# EAGLE design KMO_IO_MV2_9_mout (EAGLE 9.5.1)

## Sheet 1 of 2
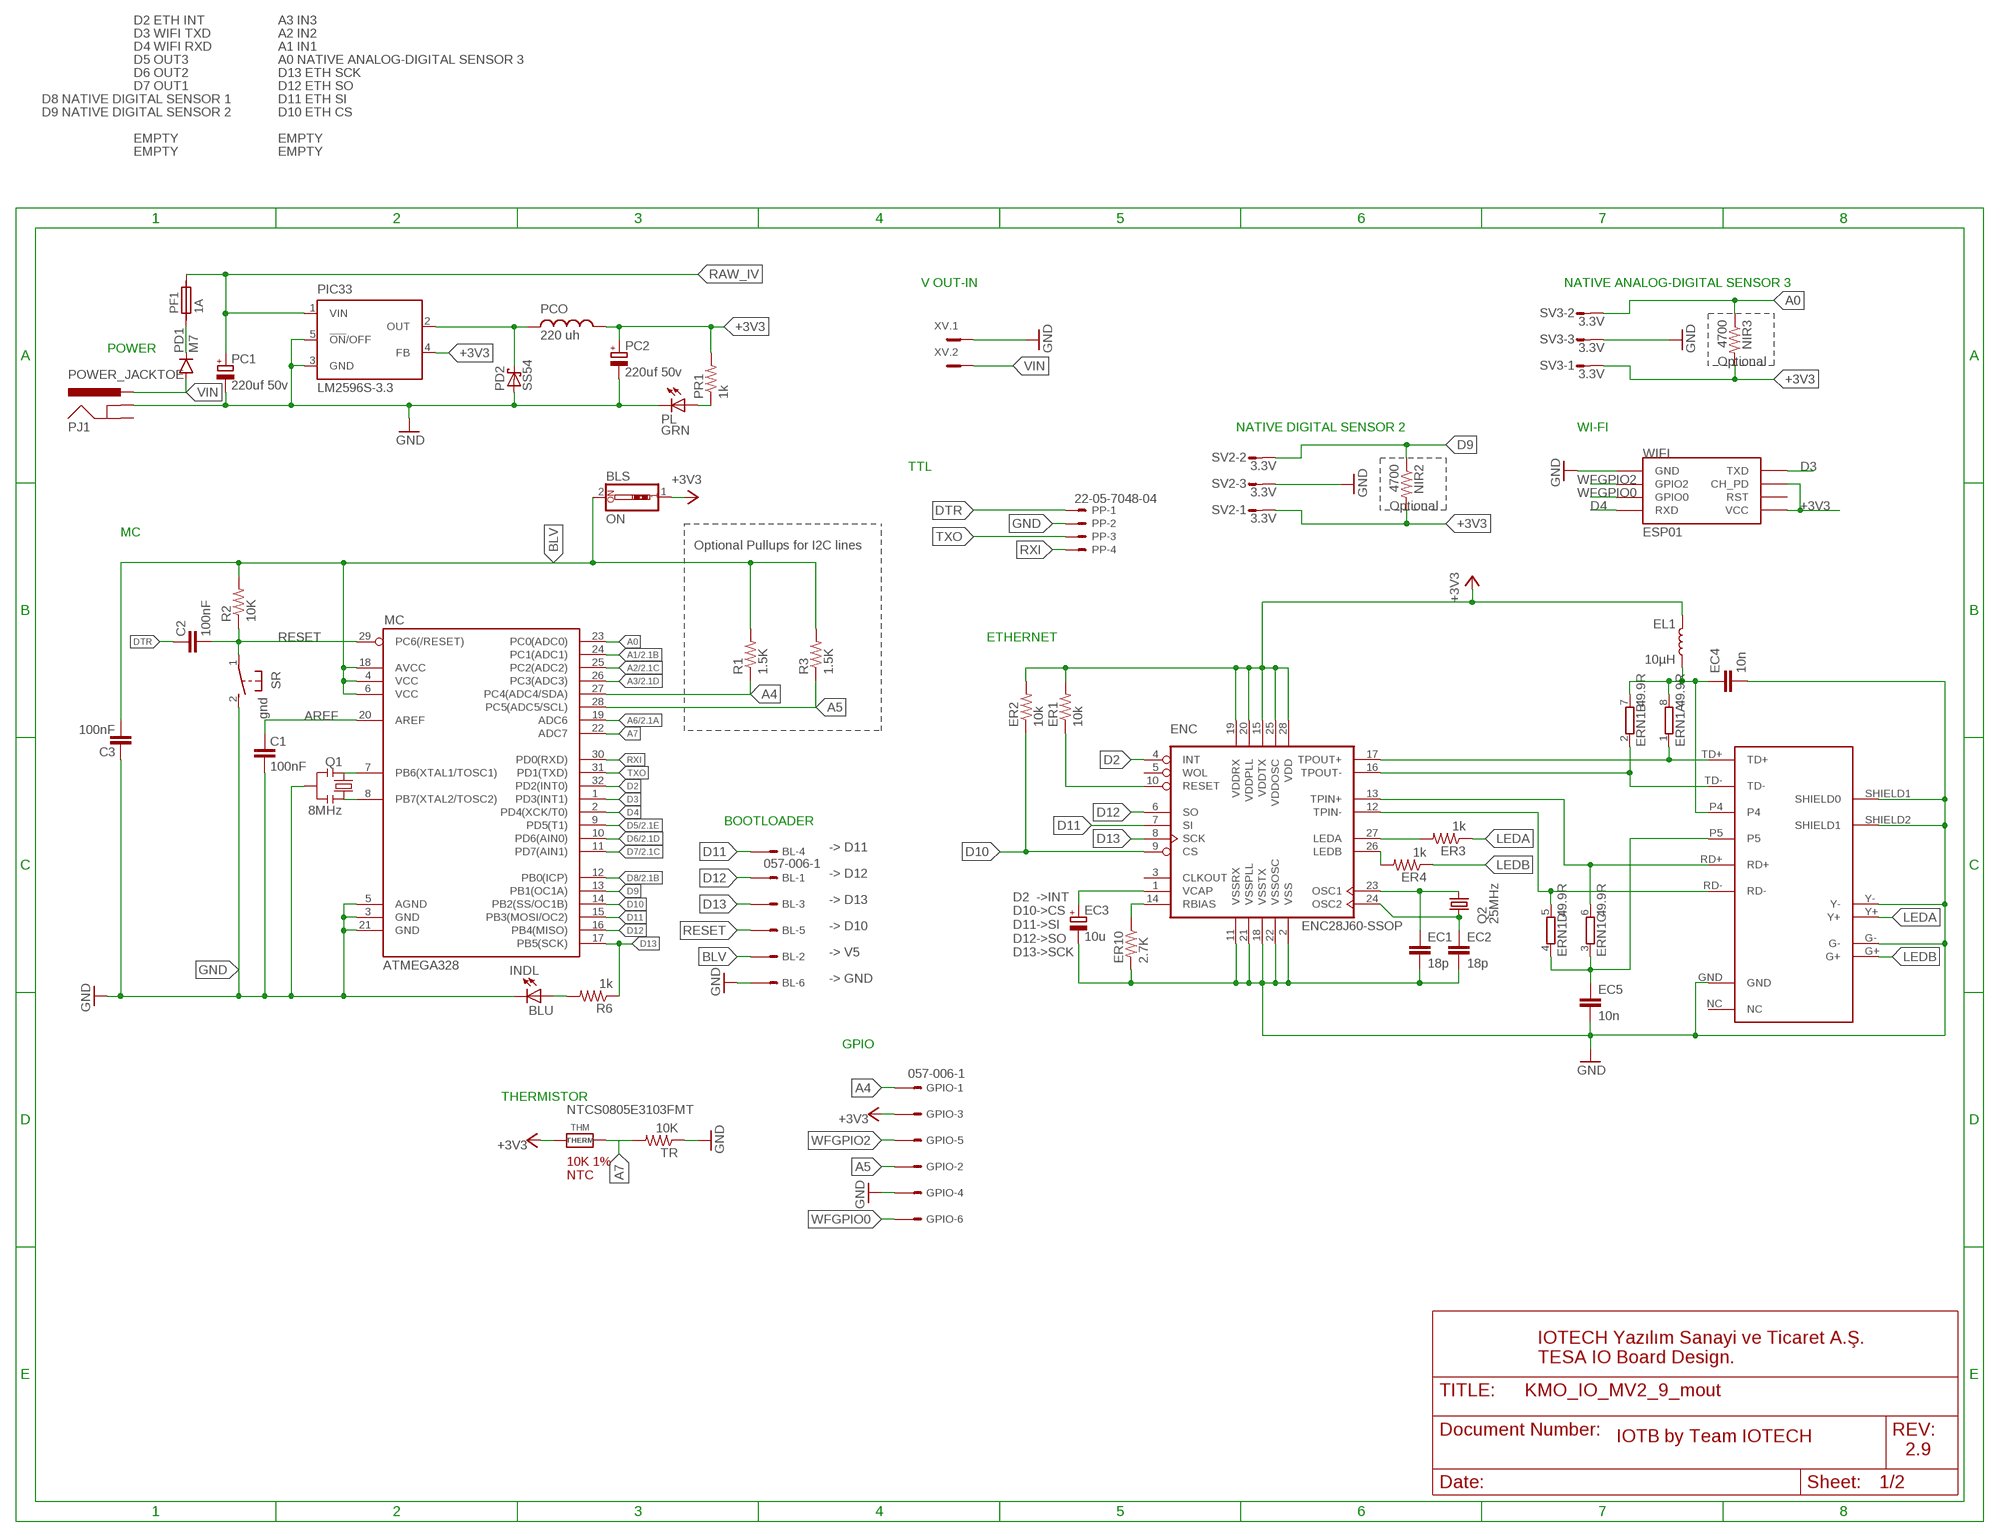
[diagram p0: schematic, sheet 1]

### Parts
BL  057-006-1  [057-006-1]
BLS  ON  SW_DIP-1  [EDG-01]
C1  100nF  CAP0805  [0805]
C2  100nF  CAP0805  [0805]
C3  100nF  CAP0805  [0805]
EC1  18p  CAP0805  [0805]
EC2  18p  CAP0805  [0805]
EC3  10u  CPOL-EUCT3216  [CT3216]
EC4  10n  CAP0805  [0805]
EC5  10n  CAP0805  [0805]
EL1  10µH  INDUCTOR-0805-3.3UH  [0805]
ENC  ENC28J60-SSOP  [SSOP28]
ER1  10k  RESISTOR0805-RES  [0805]
ER2  10k  RESISTOR0805-RES  [0805]
ER3  1k  RESISTOR0805-RES  [0805]
ER4  1k  RESISTOR0805-RES  [0805]
ER10  2.7K  RESISTOR0805-RES  [0805]
ERN1  49.9R  4R-N0603-ARV  [0603-ARV]
GPIO  057-006-1  [057-006-1]
INDL  BLU  LEDCHIP-LED0805  [CHIP-LED0805]
MC  ATMEGA328  ATMEGA168  [TQFP32-08]
NIR2  4700  RESISTOR0805-RES  [0805]
NIR3  4700  RESISTOR0805-RES  [0805]
PC1  220uf 50v  CPOL-EU140CLH-1010  [140CLH-1010]
PC2  220uf 50v  CPOL-EU140CLH-1010  [140CLH-1010]
PCO  220 uh  MSS1260  [MSS1260]
PD1  M7  DIODESMA  [SMA-DIODE]
PD2  SS54  SCHOTTKY-DIODESMD  [SMB]
PF1  1A  SIBA194600  [1820]
PIC33  LM2596S-3.3  LM2596S  [TO263-5]
PJ1  POWER_JACKTOE  [POWER_JACK_SMD_OVERPASTE_TOE]
PL  GRN  LEDCHIP-LED0805  [CHIP-LED0805]
PP  22-05-7048-04  [7395-04]
PR1  1k  RESISTOR0805-RES  [0805]
Q1  8MHz  RESONATOR1:1  [RESONATOR-SMD-1:1]
Q2  25MHz  KX-9B  [5.0X3.2_2]
R1  1.5K  RESISTOR0805-RES  [0805]
R2  10K  RESISTOR0805-RES  [0805]
R3  1.5K  RESISTOR0805-RES  [0805]
R6  1k  RESISTOR0805-RES  [0805]
SR  gnd  31-XX  [B3F-31XX]
SV2  3.3V  S03P  [S03P]
SV3  3.3V  S03P  [S03P]
THM  THERM  MICROBUILDER_RESISTOR0805_NOTHERMALS  [MICROBUILDER_0805_NOTHERMALS]
TR  10K  RESISTOR0805-RES  [0805]
U$2  HR911105A  [RJ45]
WIFI  ESP01  [ESP01]
XV  MC2  [MC2]

### Nets
+3V3 [3.3 power line]: BLS.1 EL1.1 ENC.15(VDDTX) ENC.19(VDDRX) ENC.20(VDDPLL) ENC.25(VDDOSC) ENC.28(VDD) ER1.2 ER2.2 GPIO.3 NIR2.2 NIR3.2 PC2.+ PCO.P$1 PIC33.4(FB) PR1.2 SV2.1 SV3.1 THM.1 WIFI.CH_PD WIFI.VCC
A0: MC.23(PC0(ADC0)) NIR3.1 SV3.2
A1: MC.24(PC1(ADC1)) ; also sheet 2
A2: MC.25(PC2(ADC2)) ; also sheet 2
A3: MC.26(PC3(ADC3)) ; also sheet 2
A4: GPIO.1 MC.27(PC4(ADC4/SDA)) R1.1
A5: GPIO.2 MC.28(PC5(ADC5/SCL)) R3.1
A6: MC.19(ADC6) ; also sheet 2
A7: MC.22(ADC7) THM.2 TR.2
AREF: C1.2 MC.20(AREF)
BLV: BL.2 BLS.2 C3.1 MC.4(VCC) MC.6(VCC) MC.18(AVCC) R1.2 R2.2 R3.2
D2: ENC.4(INT) MC.32(PD2(INT0))
D3: MC.1(PD3(INT1)) WIFI.TX(TXD)
D4: MC.2(PD4(XCK/T0)) WIFI.RX(RXD)
D5: MC.9(PD5(T1)) ; also sheet 2
D6: MC.10(PD6(AIN0)) ; also sheet 2
D7: MC.11(PD7(AIN1)) ; also sheet 2
D8: MC.12(PB0(ICP)) ; also sheet 2
D9: MC.13(PB1(OC1A)) NIR2.1 SV2.2
D10: ENC.9(CS) ER2.1 MC.14(PB2(SS/OC1B))
D11: BL.4 ENC.7(SI) MC.15(PB3(MOSI/OC2))
D12: BL.1 ENC.6(SO) MC.16(PB4(MISO))
D13: BL.3 ENC.8(SCK) MC.17(PB5(SCK)) R6.1
DTR: C2.2 PP.1
EP4: EC4.1 EL1.2 ERN1.7 ERN1.8 U$2.P4
EP5: EC5.1 ERN1.3 ERN1.4 U$2.P5
GND [3.3 power line]: BL.6 C1.1 C3.2 EC1.2 EC2.2 EC3.- EC4.2 EC5.2 ENC.2(VSS) ENC.11(VSSRX) ENC.18(VSSTX) ENC.21(VSSPLL) ENC.22(VSSOSC) ER10.2 GPIO.4 INDL.C MC.3(GND) MC.5(AGND) MC.21(GND) PC1.- PC2.- PD2.A PIC33.3(GND) PIC33.5(!ON!/OFF) PJ1.GND(GNDBREAK) PL.C PP.2 Q1.2 SR.2(S) SV2.3 SV3.3 TR.1 U$2.G- U$2.GND U$2.SHIELD1(SHIELD0) U$2.SHIELD2(SHIELD1) U$2.Y- WIFI.GND XV.1 ; also sheet 2
LEDA: ER3.1 U$2.Y+
LEDB: ER4.1 U$2.G+
N$2: PD1.C PF1.1
N$5: INDL.A R6.2
N$9: ENC.27(LEDA) ER3.2
N$10: MC.8(PB7(XTAL2/TOSC2)) Q1.3
N$11: PL.A PR1.1
N$13: EC3.+ ENC.1(VCAP)
N$14: ENC.26(LEDB) ER4.2
N$15: MC.7(PB6(XTAL1/TOSC1)) Q1.1
N$16: PCO.P$2 PD2.C PIC33.2(OUT)
N$17: ENC.10(RESET) ER1.1
N$19: ENC.14(RBIAS) ER10.1
N$22: EC2.1 ENC.24(OSC2) Q2.1
N$24: EC1.1 ENC.23(OSC1) Q2.2
RAW_IV [vcc]: PC1.+ PF1.2 PIC33.1(VIN)
RD+: ENC.13(TPIN+) ERN1.6 U$2.RD+
RD-: ENC.12(TPIN-) ERN1.5 U$2.RD-
RESET: BL.5 C2.1 MC.29(PC6(/RESET)) R2.1 SR.1(P)
RXI: MC.30(PD0(RXD)) PP.4
TD+: ENC.17(TPOUT+) ERN1.1 U$2.TD+
TD-: ENC.16(TPOUT-) ERN1.2 U$2.TD-
TXO: MC.31(PD1(TXD)) PP.3
VIN: PD1.A PJ1.VIN0(PWR) XV.2
WFGPIO0: GPIO.6 WIFI.GPIO0
WFGPIO2: GPIO.5 WIFI.GPIO2
Unconnected: ENC.3(CLKOUT) ENC.5(WOL) PJ1.P$4(GND) U$2.NC WIFI.RST

### Notes on the sheet
- D2 ETH INT | A3 IN3
- D3 WIFI TXD | A2 IN2
- D4 WIFI RXD | A1 IN1
- D5 OUT3 | A0 NATIVE ANALOG-DIGITAL SENSOR 3
- D6 OUT2 | D13 ETH SCK
- D7 OUT1 | D12 ETH SO
- D8 NATIVE DIGITAL SENSOR 1 | D11 ETH SI
- D9 NATIVE DIGITAL SENSOR 2 | D10 ETH CS
- EMPTY | EMPTY
- EMPTY | EMPTY
- V OUT-IN | NATIVE ANALOG-DIGITAL SENSOR 3
- POWER
- Optional
- NATIVE DIGITAL SENSOR 2 | WI-FI
- TTL
- Optional
- MC
- Optional Pullups for I2C lines
- ETHERNET
- BOOTLOADER
- -> D11
- -> D12
- -> D13
- -> D10
- -> V5
- D2  ->INT
  D10->CS
  D11->SI
  D12->SO
  D13->SCK
- -> GND
- GPIO
- THERMISTOR
- NTCS0805E3103FMT
- 10K 1%
  NTC
- IOTECH Yazılım Sanayi ve Ticaret A.Ş.
  TESA IO Board Design.
- IOTB by Team IOTECH
- 2.9

## Sheet 2 of 2
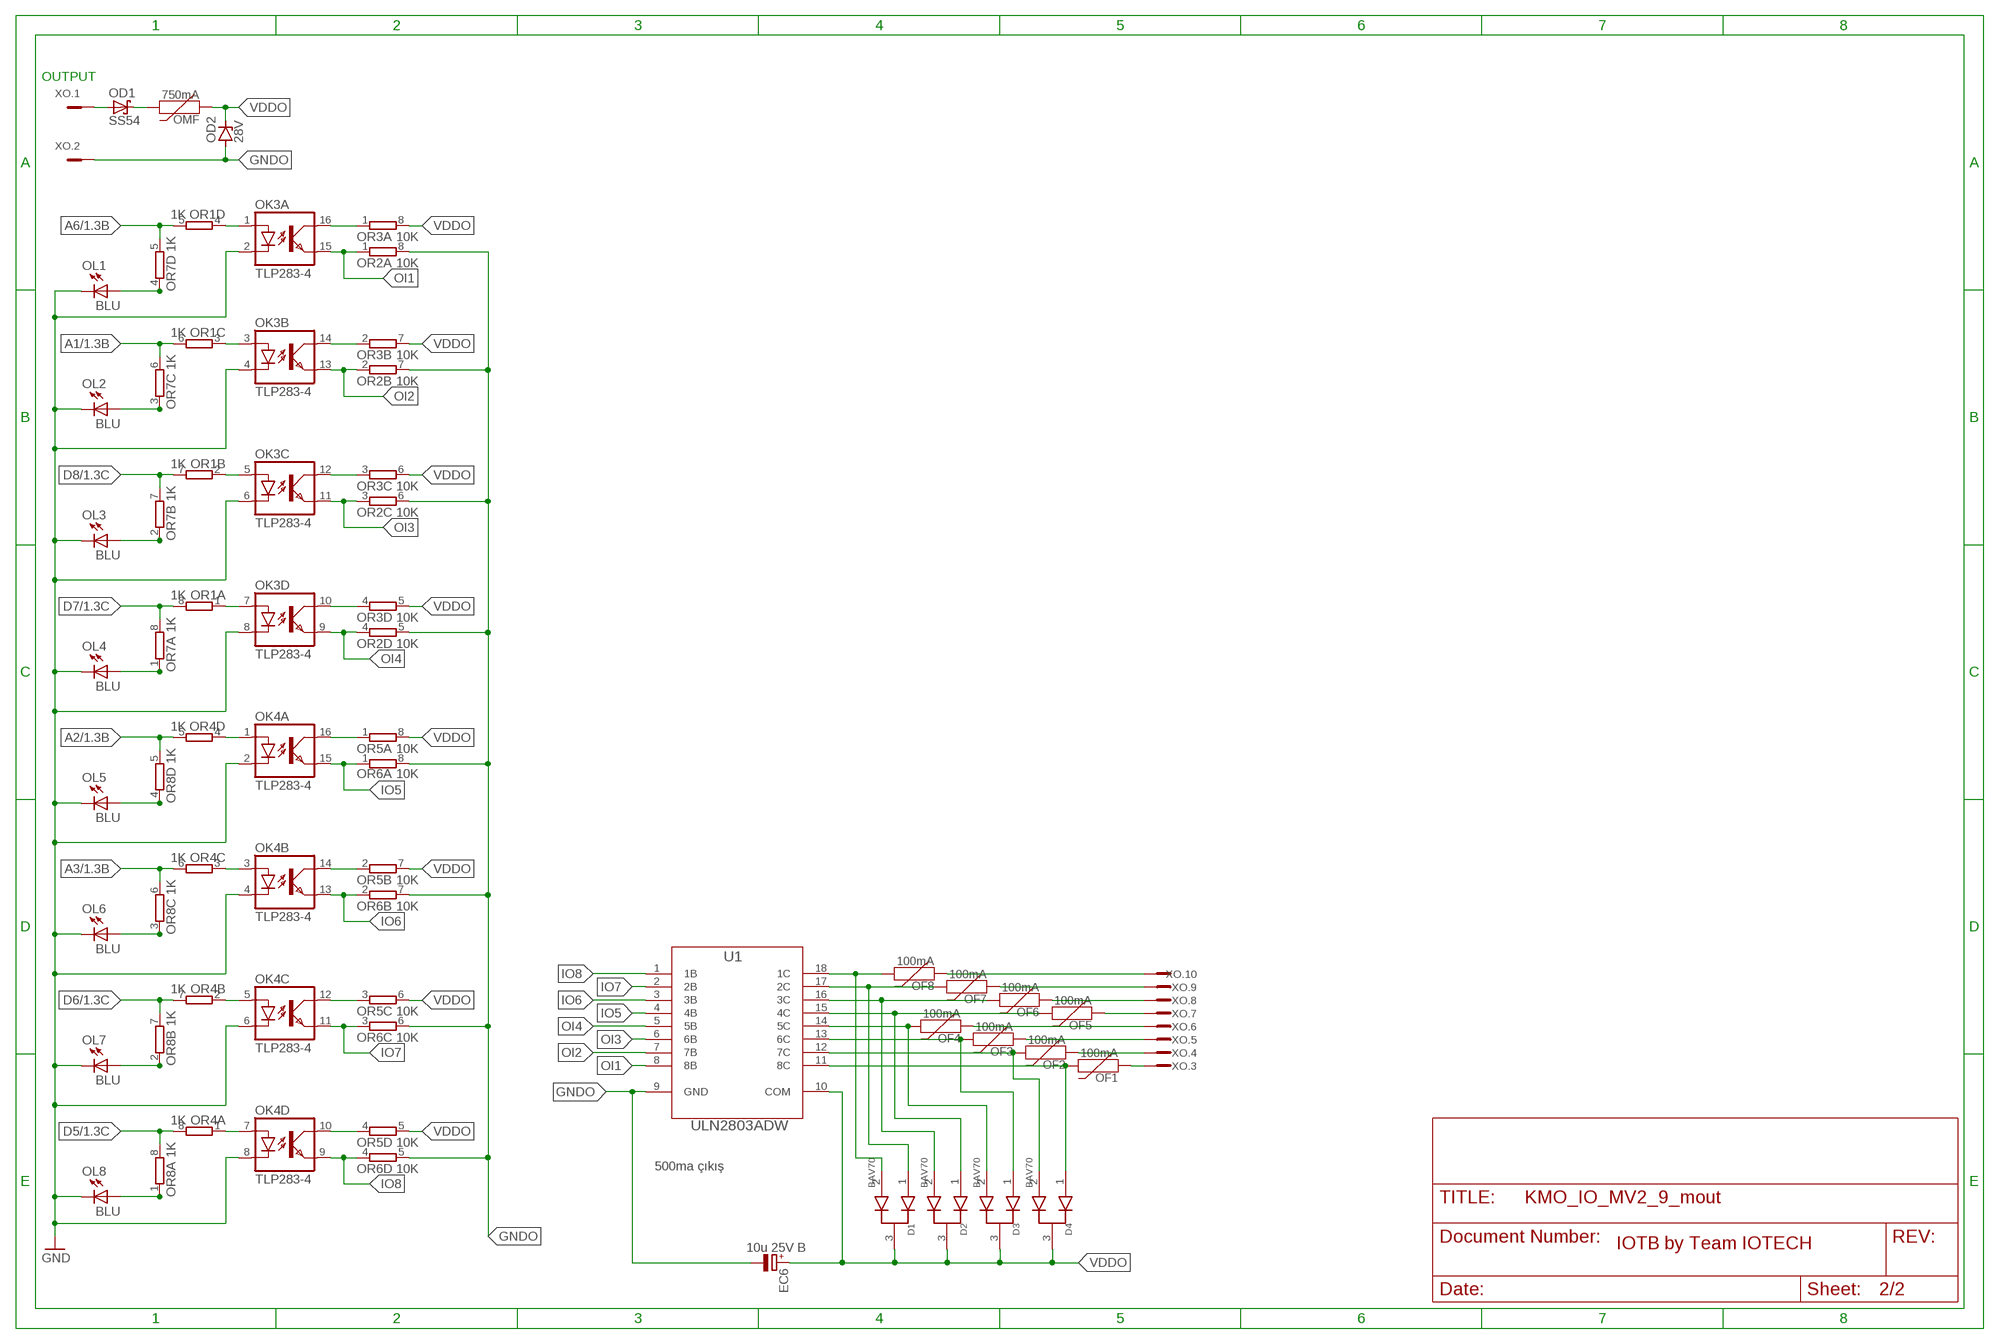
[diagram p1: schematic, sheet 2]

### Parts
D1  BAV70  [SOT-23-3]
D2  BAV70  [SOT-23-3]
D3  BAV70  [SOT-23-3]
D4  BAV70  [SOT-23-3]
EC6  10u 25V B  CPOL-EUSMCB  [SMC_B]
OD1  SS54  SCHOTTKY-DIODESMD  [SMB]
OD2  28V  ZENER-DIODESMB  [SMB]
OF1  100mA  PPTC_0.75A  [1206]
OF2  100mA  PPTC_0.75A  [1206]
OF3  100mA  PPTC_0.75A  [1206]
OF4  100mA  PPTC_0.75A  [1206]
OF5  100mA  PPTC_0.75A  [1206]
OF6  100mA  PPTC_0.75A  [1206]
OF7  100mA  PPTC_0.75A  [1206]
OF8  100mA  PPTC_0.75A  [1206]
OK3  TLP283-4  [MINI-FLAT-16]
OK4  TLP283-4  [MINI-FLAT-16]
OL1  BLU  LEDCHIP-LED0805  [CHIP-LED0805]
OL2  BLU  LEDCHIP-LED0805  [CHIP-LED0805]
OL3  BLU  LEDCHIP-LED0805  [CHIP-LED0805]
OL4  BLU  LEDCHIP-LED0805  [CHIP-LED0805]
OL5  BLU  LEDCHIP-LED0805  [CHIP-LED0805]
OL6  BLU  LEDCHIP-LED0805  [CHIP-LED0805]
OL7  BLU  LEDCHIP-LED0805  [CHIP-LED0805]
OL8  BLU  LEDCHIP-LED0805  [CHIP-LED0805]
OMF  750mA  PPTC_0.75A  [1206]
OR1  1K  4R-N0603-ARV  [0603-ARV]
OR2  10K  4R-N0603-ARV  [0603-ARV]
OR3  10K  4R-N0603-ARV  [0603-ARV]
OR4  1K  4R-N0603-ARV  [0603-ARV]
OR5  10K  4R-N0603-ARV  [0603-ARV]
OR6  10K  4R-N0603-ARV  [0603-ARV]
OR7  1K  4R-N0603-ARV  [0603-ARV]
OR8  1K  4R-N0603-ARV  [0603-ARV]
U1  ULN2803ADW  [SOIC127P1030X265-18N]
XO  MC10  [MC10]

### Nets
A1: OR1.6 OR7.6 ; also sheet 1
A2: OR4.5 OR8.5 ; also sheet 1
A3: OR4.6 OR8.6 ; also sheet 1
A6: OR1.5 OR7.5 ; also sheet 1
D5: OR4.8 OR8.8 ; also sheet 1
D6: OR4.7 OR8.7 ; also sheet 1
D7: OR1.8 OR7.8 ; also sheet 1
D8: OR1.7 OR7.7 ; also sheet 1
GND [3.3 power line]: OK3.2(A:C) OK3.4(B:C) OK3.6(C:C) OK3.8(D:C) OK4.2(A:C) OK4.4(B:C) OK4.6(C:C) OK4.8(D:C) OL1.C OL2.C OL3.C OL4.C OL5.C OL6.C OL7.C OL8.C ; also sheet 1
GNDO [outsise power line]: EC6.- OD2.A OR2.5 OR2.6 OR2.7 OR2.8 OR6.5 OR6.6 OR6.7 OR6.8 U1.9(GND) XO.2
IO5: OK4.15(A:EMIT) OR6.1 U1.4(4B)
IO6: OK4.13(B:EMIT) OR6.2 U1.3(3B)
IO7: OK4.11(C:EMIT) OR6.3 U1.2(2B)
IO8: OK4.9(D:EMIT) OR6.4 U1.1(1B)
N$1: OD1.A XO.1
N$4: OD1.C OMF.2
N$6: OF8.1 XO.10
N$7: D1.1 OF7.2 U1.17(2C)
N$8: OK3.1(A:A) OR1.4
N$35: OK3.3(B:A) OR1.3
N$45: OK3.5(C:A) OR1.2
N$46: OK3.7(D:A) OR1.1
N$47: D1.2 OF8.2 U1.18(1C)
N$48: OK3.16(A:COL) OR3.1
N$49: D2.2 OF6.2 U1.16(3C)
N$50: D2.1 OF5.2 U1.15(4C)
N$51: OF7.1 XO.9
N$52: OF6.1 XO.8
N$53: OK3.14(B:COL) OR3.2
N$54: OF5.1 XO.7
N$55: OF4.1 XO.6
N$56: OK3.12(C:COL) OR3.3
N$57: D3.1 OF3.2 U1.13(6C)
N$58: OK3.10(D:COL) OR3.4
N$59: D4.2 OF2.2 U1.12(7C)
N$60: OL1.A OR7.4
N$61: OL2.A OR7.3
N$62: OL3.A OR7.2
N$63: OL4.A OR7.1
N$64: D4.1 OF1.2 U1.11(8C)
N$65: D3.2 OF4.2 U1.14(5C)
N$66: OF3.1 XO.5
N$67: OF2.1 XO.4
N$68: OF1.1 XO.3
N$69: OK4.1(A:A) OR4.4
N$70: OK4.3(B:A) OR4.3
N$71: OK4.5(C:A) OR4.2
N$72: OK4.7(D:A) OR4.1
N$73: OK4.16(A:COL) OR5.1
N$74: OK4.14(B:COL) OR5.2
N$75: OK4.12(C:COL) OR5.3
N$76: OK4.10(D:COL) OR5.4
N$77: OL5.A OR8.4
N$78: OL6.A OR8.3
N$79: OL7.A OR8.2
N$80: OL8.A OR8.1
OI1: OK3.15(A:EMIT) OR2.1 U1.8(8B)
OI2: OK3.13(B:EMIT) OR2.2 U1.7(7B)
OI3: OK3.11(C:EMIT) OR2.3 U1.6(6B)
OI4: OK3.9(D:EMIT) OR2.4 U1.5(5B)
VDDO [outsise power line]: D1.3 D2.3 D3.3 D4.3 EC6.+ OD2.C OMF.1 OR3.5 OR3.6 OR3.7 OR3.8 OR5.5 OR5.6 OR5.7 OR5.8 U1.10(COM)

### Notes on the sheet
- OUTPUT
- 500ma çıkış
- IOTB by Team IOTECH

## Library data of the parts
BL GPIO = con-panduit:057-006-: CONNECTOR 6-pin series 057 contact pc board low profile headers; OC_FARNELL: unknown; OC_NEWARK: unknown
BLS = special:SW_DIP-1: DIP SWITCH
C1-C3 EC1 EC2 EC4 EC5 = SparkFun-Passives:CAP: Capacitor Standard 0603 ceramic capacitor, and 0.1" leaded capacitor.
D1-D4 = BAV70:BAV70; AVAILABILITY: Unavailable; DESCRIPTION: Diode, Dual Switching, Sot-23; MF: Multicomp; MP: BAV70+; PACKAGE: SOT-23 Multicomp; PRICE: None
EC3 EC6 PC1 PC2 = rcl:CPOL-EU: POLARIZED CAPACITOR, European symbol; SPICEPREFIX: C
EL1 = SparkFun-Coils:INDUCTOR: Inductors Resist changes in electrical current. Basically a coil of wire. SparkFun Products: SparkFun Load Cell Amplifier - HX711 <https://www.sparkfun.com/products/13879> IOIO-OTG - V2.2 <https://www.sparkfun.com/products/13613>; PROD_ID: NDUC-13076; VALUE: 3.3µH/±20%/450mA
ENC = microchip-enc28j60:ENC28J60-*: Microchip 10Mbit Eth. contoller with SPI interface
ER1-ER4 ER10 NIR2 NIR3 PR1 R1-R3 R6 TR = SparkFun-Passives:RESISTOR: Resistor Basic schematic elements and footprints for 0603, 1206, and PTH resistors.
ERN1 OR1-OR8 = resistor-dil:4R-N: Array Chip Resistor Source: RS Component / Phycomp; OC_FARNELL: unknown; OC_NEWARK: unknown
INDL OL1-OL8 PL = led:LED: LED OSRAM: - CHIPLED LG R971, LG N971, LY N971, LG Q971, LY Q971, LO R971, LY R971 LH N974, LH R974 LS Q976, LO Q976, LY Q976 LO Q996 - Hyper CHIPLED LW Q18S LB Q993, LB Q99A, LB R99A - SideLED LS A670, LO A670, LY A670, LG A670, LP A670 LB A673, LV A673, LT A673, LW A673 LH A674 LY A675 LS A676, LA A676, LO A676, LY A676, LW A676 LS A679, LY A679, LG A679 - Hyper Micro SIDELED® LS Y876, LA Y876, LO Y876, LY Y876 LT Y87S - SmartLED LW L88C, LW L88S LB L89C, LB L89S, LG L890 LS L89K, LO L89K, LY L89K LS L896, LA L896, LO L896, LY L896 - TOPLED LS T670, LO T670, LY T670, LG T670, LP T670 LSG T670, LSP T670, LSY T670, LOP T670, LYG T670 LG T671, LOG T671, LSG T671 LB T673, LV T673, LT T673, LW T673 LH T674 LS T676, LA T676, LO T676, LY T676, LB T676, LH T676, LSB T676, LW T676 LB T67C, LV T67C, LT T67C, LS T67K, LO T67K, LY T67K, LW E67C LS E67B, LA E67B, LO E67B, LY E67B, LB E67C, LV E67C, LT E67C LW T67C LS T679, LY T679, LG T679 LS T770, LO T770, LY T770, LG T770, LP T770 LB T773, LV T773, LT T773, LW T773 LH T774 LS E675, LA E675, LY E675, LS T675 LS T776, LA T776, LO T776, LY T776, LB T776 LHGB T686 LT T68C, LB T68C - Hyper Mini TOPLED® LB M676 - Mini TOPLED Santana® LG M470 LS M47K, LO M47K, LY M47K Source: http://www.osram.convergy.de LUXEON: - LUMILED® LXK2-PW12-R00, LXK2-PW12-S00, LXK2-PW14-U00, LXK2-PW14-V00 LXK2-PM12-R00, LXK2-PM12-S00, LXK2-PM14-U00 LXK2-PE12-Q00, LXK2-PE12-R00, LXK2-PE12-S00, LXK2-PE14-T00, LXK2-PE14-U00 LXK2-PB12-K00, LXK2-PB12-L00, LXK2-PB12-M00, LXK2-PB14-N00, LXK2-PB14-P00, LXK2-PB14-Q00 LXK2-PR12-L00, LXK2-PR12-M00, LXK2-PR14-Q00, LXK2-PR14-R00 LXK2-PD12-Q00, LXK2-PD12-R00, LXK2-PD12-S00 LXK2-PH12-R00, LXK2-PH12-S00 LXK2-PL12-P00, LXK2-PL12-Q00, LXK2-PL12-R00 Source: www.luxeon.com KINGBRIGHT: KA-3528ASYC Source: www.kingbright.com
MC = SparkFun:ATMEGA168
OD1 PD2 = diode:SCHOTTKY-DIODE: Schottky Diode
OD2 = diode:ZENER-DIODE: Z-Diode
OF1-OF8 OMF = SparkFun-Fuses:PPTC: Resettable Fuse PPTC Resettable Fuse. Really a sort of resistor with a polymeric positive temperature coefficient whose resistance increases dramatically with an increase in temperature. When heated by the power passing through the resistance rises causing the current to be limited, protecting the circuit. This is achieved by the transition of the polymer from a crystalline to an amorphous state where the conductive carbon separates breaking the conductive pathways found in the cool crystalline structure. When a PPTC cools back down it resumes conducting letting the circuit turn back on. SparkFun Products: SparkFun RedBoard - Programmed with Arduino <https://www.sparkfun.com/products/12757> Pro Micro - 5V/16MHz <https://www.sparkfun.com/products/12640> Arduino Pro 328 - 5V/16MHz <https://www.sparkfun.com/products/10915> MP3 Trigger <https://www.sparkfun.com/products/13720>; PROD_ID: RES-11150; VALUE: 6V/0.75A
OK3 OK4 = optocoupler:TLP283-4: TOSHIBA PHOTOCOUPLER GaAs IRED & PHOTO-TRANSISTOR Source: http://www.semicon.toshiba.co.jp/td/en/Opto/Photocoupler/en_20050928_TLP283_datasheet.pdf; OC_FARNELL: unknown; OC_NEWARK: unknown
PCO = inductor-coilcraft:MSS1260: SMT Power Inductor
PD1 = SparkFun-DiscreteSemi:DIODE: Diode These are standard reverse protection diodes and small signal diodes. SMA package can handle up to about 1A. SOD-323 can handle about 200mA. What the SOD-323 package when ordering, there are some mfgs out there that are 5-pin packages.
PF1 = _hhn_PtcFuses_Siba_r500_Ozan:SIBA194600*: SIBA PTC-Fuses, Series 194600, 1812 (4.5 3.2)mm Source: www.siba.de/ Package: SMD 1812 (4.5 x 3.2)mm Technologies: SIBA194600Axxx xxx: Trip-Current * 10 mA Author: Dipl.-Ing. FH Rainer Bayer
PIC33 = national-semiconductor:LM2596: SIMPLE SWITCHER® Power Converter 150 kHz 3A Step-Down Voltage Regulator Source: http://www.national.com/ds/LM/LM2596.pdf; MF: NATIONAL SEMICONDUCTOR; MPN: LM2596S-ADJ/NOPB; OC_FARNELL: 9494367; OC_NEWARK: 41K3842; SPICEPREFIX: X
PJ1 = SparkFun-Connectors:POWER_JACK: Power Jack Connector This is the standard 5.5mm barrel jack for power. The PTH is the most common, proven, reliable, footprint. The Slot footprint only works if the mill layer is transmitted to the PCB fab house so be warned. Here are the connectors we sell at SparkFun: DC Barrel Power Jack/Connector <https://www.sparkfun.com/products/119> (PRT-00119) DC Barrel Power Jack/Connector (SMD) <https://www.sparkfun.com/products/12748> (PRT-12748) DC Barrel Jack Adapter - Breadboard Compatible <https://www.sparkfun.com/products/10811> (PRT-10811) It is used on this SparkFun product (and many, many others): SparkFun RedBoard - Programmed with Arduino <https://www.sparkfun.com/products/12757> (DEV-12757) Also, if you need a mating power supply or connector, please check these out: Wall Adapter Power Supply - 9VDC 650mA <https://www.sparkfun.com/products/298> (TOL-00298) DC Barrel Jack Adapter - Male <https://www.sparkfun.com/products/10287> (PRT-10287); PROD_ID: CONN-08106; SF_ID: PRT-12748
PP = con-molex:22-?-04: CONNECTOR wire to board 2.54 mm (.1 inch) pitch header; MF: MOLEX; OC_FARNELL: unknown; OC_NEWARK: unknown
Q1 = Testing:RESONATOR: Resonator Small SMD resonator. This is the itty bitty 10/20MHz resonators with built in caps. CSTCE10M0G55 and CSTCE20M0V53. Footprint for SMD has been used in SFE production for years, and does work okay. 1:1 is an attempt to get larger fillets on the sides so it will be easier to inspect these solders in our AOI machine. The pads have been minimized to match the actual metal under the resonator. To see this relation, it includes an image import of the bottom side of the component. Imported to scale on layer 200.
Q2 = crystal-geyer_V1_0:KX: Quartz Crystals (MHz) SMD: KX - Serie Model Size l/w/h [mm] Frequency Range Frequency Stability Temp. Range [°C] Load Capacitance AECQ 200 availabel Datasheet KX-4 KX-5 KX-6 KX-7 KX-9A KX-9B KX-12A KX-12B KX-13 KX-20 KX-K KX-KS 1.6/1.2/0.3 2.0/1.6/0.45 2.5/2.0/0.55 3.2/2.5/0.8 5.0/3.2/1.0 5.0/3.2/1.1 6.0/3.5/1.1 6.0/3.5/1.0 7.0/5.0 /1.3 11.6/5.5/1.6 12.3/4.5/4.2 12.3/4.5/3.2 24.0 ~ 80.0 MHz 16.0 ~ 80.0 MHz 12.0 ~ 80.0 MHz 8.0 ~ 60.0 MHz 7,68 ~ 300,0 MHz 8,0 ~ 50,0 MHz 8,0 ~ 150,0 MHz 8,0 ~ 50,0 MHz 6,0 ~ 160,0 MHz 3,579 ~ 25,0 MHz 3,579 ~ 70,0 MHz 3,579 ~ 70,0 MHz ±10 … ±50ppm ±10 … ±50ppm ±10 … ±50ppm ±10 … ±50ppm ±10 … ±50ppm ±10 … ±50ppm ±10 … ±50ppm ±10 … ±50ppm ±10 … ±50ppm ±50ppm ±10 … ±50ppm ±10 … ±50ppm (*) -40°C …+85°C (*) -40°C …+125°C (*) -40°C …+125°C (*) -40°C …+125°C (*) -40°C …+105°C (*) -40°C …+105°C (*) -40°C …+125°C (*) -40°C …+105°C (*) -40°C …+105°C (*) -40°C …+105°C (*) -40°C …+85°C (*) -40°C …+85°C 8, 8…16 8, 8…16 10, 8…16 12, 7…20 16, 10…20 16, 10…20 16, 10…20 16, 12…20 16, 12…20 16, 12…20 16, 12…30 16, 12…30 - yes yes yes - - - - - - - - KX-4.pdf <http://www.geyer-electronic.de/uploads/tx_userartikelfrequenz/GEYER-KX-4.pdf> KX-5.pdf <http://www.geyer-electronic.de/uploads/tx_userartikelfrequenz/GEYER-KX-5.pdf> KX-6.pdf <http://www.geyer-electronic.de/uploads/tx_userartikelfrequenz/GEYER-KX-6.pdf> KX-7.pdf <http://www.geyer-electronic.de/uploads/tx_userartikelfrequenz/GEYER-KX-7.pdf> KX-9A.pdf <http://www.geyer-electronic.de/uploads/tx_userartikelfrequenz/GEYER-KX-9A.pdf> KX-9B.pdf <http://www.geyer-electronic.de/uploads/tx_userartikelfrequenz/GEYER-KX-9B.pdf> KX-12A.pdf <http://www.geyer-electronic.de/uploads/tx_userartikelfrequenz/GEYER-KX-12A.pdf> KX-12B.pdf <http://www.geyer-electronic.de/uploads/tx_userartikelfrequenz/GEYER-KX-12B.pdf> KX-13.pdf <http://www.geyer-electronic.de/uploads/tx_userartikelfrequenz/GEYER-KX-13.pdf> KX-20.pdf <http://www.geyer-electronic.de/uploads/tx_userartikelfrequenz/GEYER-KX-20.pdf> KX-K.pdf <http://www.geyer-electronic.de/uploads/tx_userartikelfrequenz/GEYER-KX-K.pdf> KX-KS.pdf <http://www.geyer-electronic.de/uploads/tx_userartikelfrequenz/GEYER-KX-KS.pdf> <http://www.geyer-electronic.de/fileadmin/template/img/logo-geyer-electronic.png> Details see: http://www.geyer-electronic.de/Frequenz-Produkte.9.0.html Created 2016-06-07, Hans Locher 2016 (C) Geyer Quartz Technology KX4,KX5,KX6,KX7,KX9A,KX9B,KX12A,KX12B,KX13,KX20,KXK,KXKS;1612;2016;2520;3225;5032;6035;7050;11655;12345;1,6x1,2;2,0x1,6;2,5x2,0;3,2x2,5;5,0x3,2;6,0x3,5;7,0x5,0;11,6x5,5;12,3x4,5;12,3x4,5;1.6x1.2;2.0x1.6;2.5x2.0;3.2x2.5;5.0x3.2;6.0x3.5;7.0x5.0;11.6x5.5;12.3x4.5;12.3x4.5;
SR = switch-omron:31-XX: OMRON SWITCH; MPN: B3F-3100; OC_FARNELL: 959704; OC_NEWARK: 36M3582
SV2 SV3 = con_io_sxp:S03P: AMP MT CONNECTOR
THM = Adafruit Circuit Playground Express:MICROBUILDER_RESISTOR: Resistors For new designs, use the packages preceded by an '_' character since they are more reliable: The following footprints should be used on most boards: _0402 - Standard footprint for regular board layouts _0603 - Standard footprint for regular board layouts _0805 - Standard footprint for regular board layouts _1206 - Standard footprint for regular board layouts For extremely tight-pitch boards where space is at a premium, the following 'micro-pitch' footprints can be used (smaller pads, no silkscreen outline, etc.): _0402MP - Micro-pitch footprint for very dense/compact boards _0603MP - Micro-pitch footprint for very dense/compact boards _0805MP - Micro-pitch footprint for very dense/compact boards _1206MP - Micro-pitch footprint for very dense/compact boards
U1 = ULN2803ADW:ULN2803ADW: Darlington transistor array; MPN: ULN2803ADW; OC_FARNELL: 1652419; OC_NEWARK: 69K0711; PACKAGE: SOIC-18; SUPPLIER: TEXAS INSTRUMENTS
U$2 = HR911105A:HR911105A
WIFI = esp8266modules:ESP01: ESP8266 Wifi module 01
XO = con-phoenix-381_l:MC10: Mini-Combicon 3.81mm horizontal 10-polig (ohne Gegenstecker)
XV = con-phoenix-381_l:MC2: Mini-Combicon 3.81mm horizontal 2-polig (ohne Gegenstecker)

## Net classes
0 default: width 0.203 mm, drill 0.3 mm, clearance 0.16 mm
1 vcc: width 0.254 mm, drill 0.3 mm, clearance 0.16 mm
2 3.3 power line: width 0.254 mm, drill 0.3 mm, clearance 0.16 mm
3 outsise power line: width 0.254 mm, drill 0.3 mm, clearance 0.16 mm

## Board
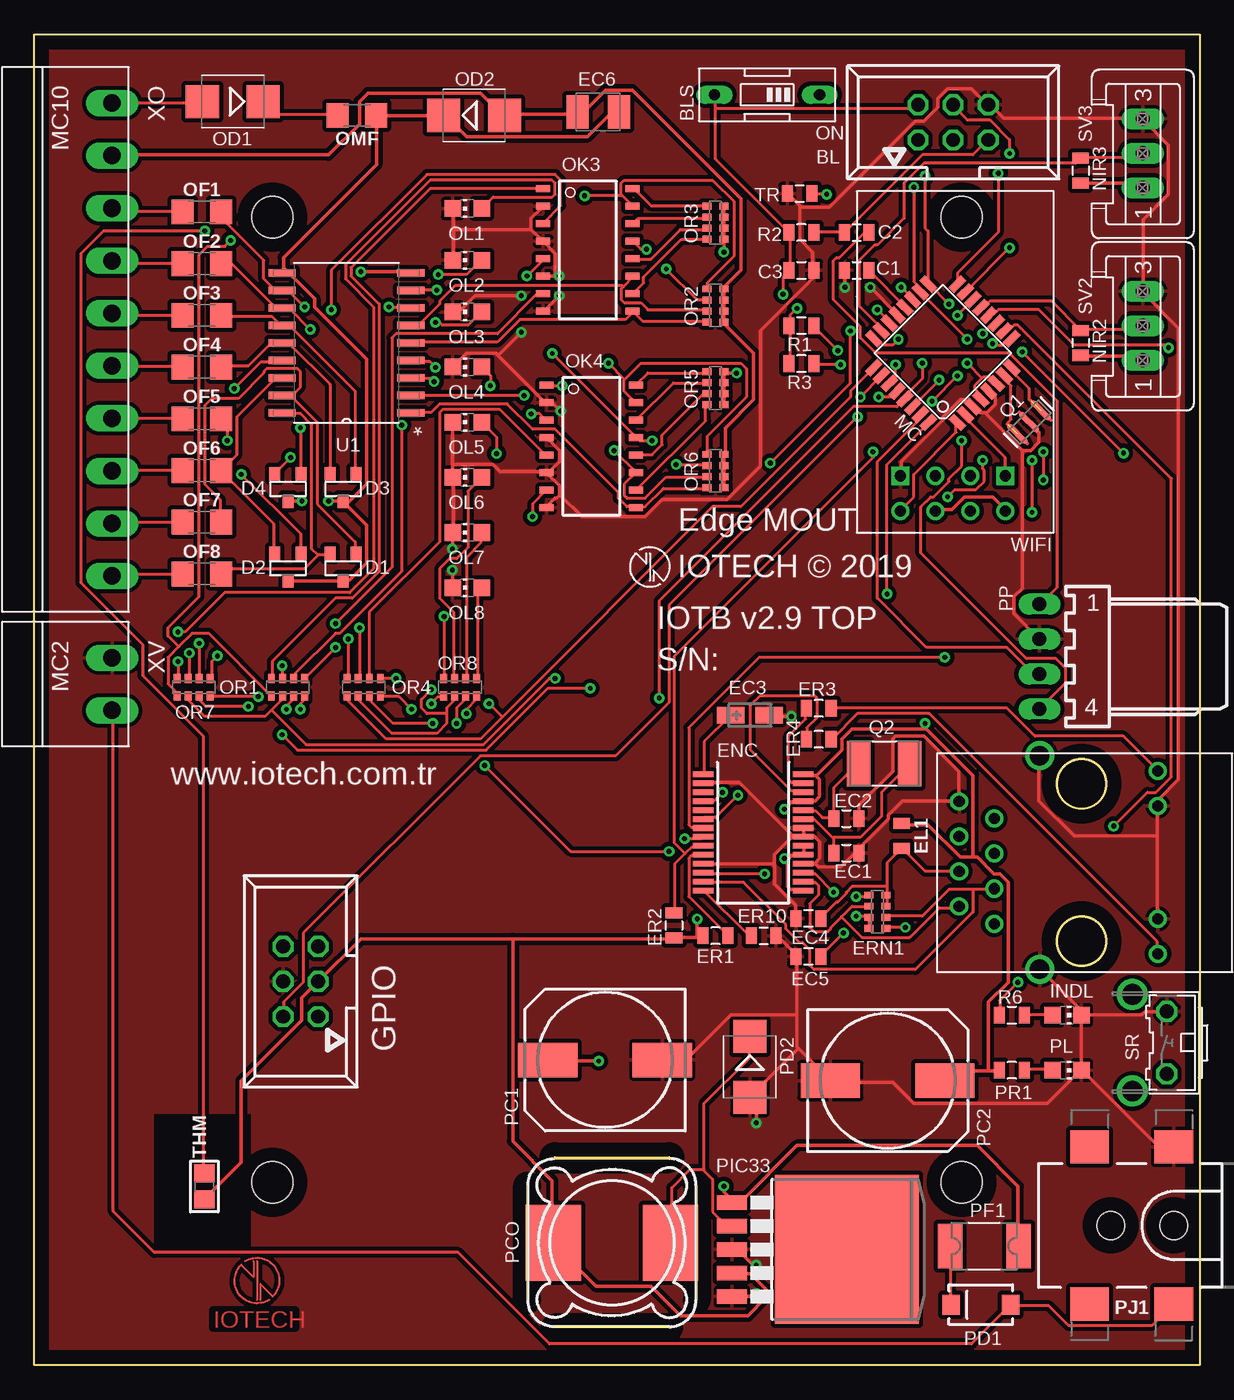
[diagram p2: board, top side]
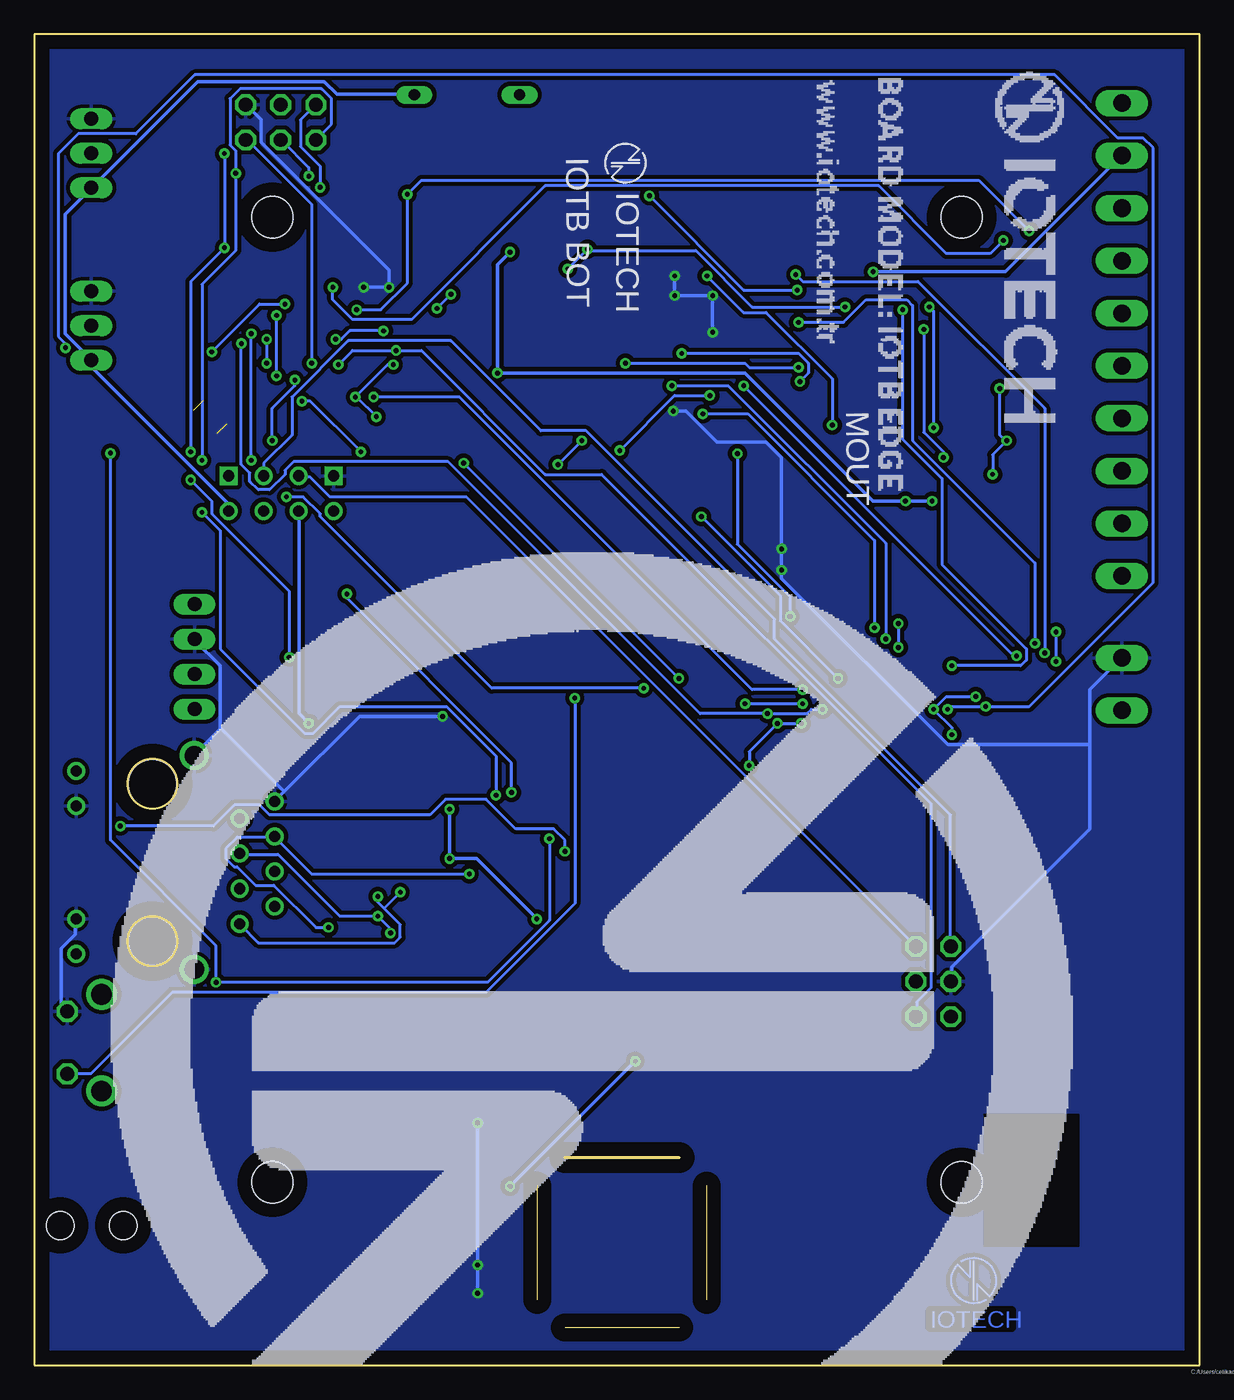
[diagram p3: board, bottom side, seen from below]

Size 84.5 x 96.5 mm. Coordinates in mm from the lower left corner, seen from the top.
Outline: 0,0 0,96.5 84.5,96.5 84.5,0 0,0
Copper layers (1*16): Top 0.035mm / dielectric 1.5mm / Bottom 0.035mm
Design rules "KMO_IO_M": minimum track width 6mil, minimum drill 0.35mm, track to track 0.205mm, track to pad 0.205mm, pad to pad 0.205mm, via to via 0.205mm, smd to smd 6mil, copper to edge 40mil, drill to drill 6mil, minimum pad ring 10mil, minimum via ring 8mil, stop-mask expansion 4mil, vias tented up to drill 0mil, thermal gap 10mil
Holes 3 mm at 17.25,83.25 67.25,83.25 17.25,13.25 67.25,13.25

### Footprints (pad centres in the part's own frame; a part is rotated, then mirrored left to right if it is on the bottom)
057-006-1 = drill 1 octagon: 1 -2.54,-1.27; 2 -2.54,1.27; 3 0,-1.27; 4 0,1.27; 5 2.54,-1.27; 6 2.54,1.27
EDG-01 = drill 0.813 long: 1 0,-3.81; 2 0,3.81
0805 = smd 0.8 x 1.2: 1 -0.9,0; 2 0.9,0
SOT-23-3 = smd 0.802 x 0.972: 1 -0.95,-1; 2 0.95,-1; 3 0,1
CT3216 = smd 2 x 1.2: + -1.4,0; - 1.4,0
SMC_B = smd 1.6 x 2.4: + -1.5,0; - 1.5,0
SSOP28 = smd 0.4 x 1.5: 1 -4.225,-3.625; 2 -3.575,-3.625; 3 -2.925,-3.625; 4 -2.275,-3.625; 5 -1.625,-3.625; 6 -0.975,-3.625; 7 -0.325,-3.625; 8 0.325,-3.625; 9 0.975,-3.625; 10 1.625,-3.625; 11 2.275,-3.625; 12 2.925,-3.625; 13 3.575,-3.625; 14 4.225,-3.625; 15 4.225,3.625; 16 3.575,3.625; 17 2.925,3.625; 18 2.275,3.625; 19 1.625,3.625; 20 0.975,3.625; 21 0.325,3.625; 22 -0.325,3.625; 23 -0.975,3.625; 24 -1.625,3.625; 25 -2.275,3.625; 26 -2.925,3.625; 27 -3.575,3.625; 28 -4.225,3.625
0603-ARV = smd 0.5 x 0.65: 1 -1.2,-0.625; 2 -0.4,-0.625; 3 0.4,-0.625; 4 1.2,-0.625; 5 1.2,0.625; 6 0.4,0.625; 7 -0.4,0.625; 8 -1.2,0.625
CHIP-LED0805 = smd 1.2 x 1.2: A 0,-1.05; C 0,1.05
TQFP32-08 = smd 1.27 x 0.559: 1 -4.293,2.8; 2 -4.293,2; 3 -4.293,1.2; 4 -4.293,0.4; 5 -4.293,-0.4; 6 -4.293,-1.2; 7 -4.293,-2; 8 -4.293,-2.8; 17 4.293,-2.8; 18 4.293,-2; 19 4.293,-1.2; 20 4.293,-0.4; 21 4.293,0.4; 22 4.293,1.2; 23 4.293,2; 24 4.293,2.8 | smd 0.559 x 1.27: 9 -2.8,-4.293; 10 -2,-4.293; 11 -1.2,-4.293; 12 -0.4,-4.293; 13 0.4,-4.293; 14 1.2,-4.293; 15 2,-4.293; 16 2.8,-4.293; 25 2.8,4.293; 26 2,4.293; 27 1.2,4.293; 28 0.4,4.293; 29 -0.4,4.293; 30 -1.2,4.293; 31 -2,4.293; 32 -2.8,4.293
SMB = smd 2.4 x 2.4: A 2.2,0; C -2.2,0
1206 = smd 1.6 x 1.8: 1 -1.4,0; 2 1.4,0
MINI-FLAT-16 = smd 1 x 0.5: 1 -3.24,4.445; 2 -3.24,3.175; 3 -3.24,1.905; 4 -3.24,0.635; 5 -3.24,-0.635; 6 -3.24,-1.905; 7 -3.24,-3.175; 8 -3.24,-4.445; 9 3.24,-4.445; 10 3.24,-3.175; 11 3.24,-1.905; 12 3.24,-0.635; 13 3.24,0.635; 14 3.24,1.905; 15 3.24,3.175; 16 3.24,4.445
140CLH-1010 = smd 4.3 x 2.5: + 4.15,0; - -4.15,0
MSS1260 = smd 5.5 x 4: P$1 0,4.25; P$2 0,-4.25
SMA-DIODE = smd 1.27 x 1.47: A -2.15,0; C 2.15,0
1820 = smd 1.78 x 3.2: 1 -2.49,0; 2 2.49,0
TO263-5 = smd 1.067 x 2.159: 1 -3.404,-5.791; 2 -1.702,-5.791; 3 0,-5.791; 4 1.702,-5.791; 5 3.404,-5.791 | smd 10.8 x 10.41: 6 0,2.54
POWER_JACK_SMD_OVERPASTE_TOE = smd 2.8 x 2.4: GND 0,-5.7; P$4 6.1,-5.7; VIN0 0,5.7; VIN1 6.1,5.7 | hole 2.032: 0,0; 4.572,0
7395-04 = drill 1.016 long: 1 3.81,0; 2 1.27,0; 3 -1.27,0; 4 -3.81,0
RESONATOR-SMD-1:1 = smd 0.45 x 1.905: 1 -1.2,0; 2 0,0; 3 1.2,0
5.0X3.2_2 = smd 1.7 x 3.3: 1 -1.85,0; 2 1.85,0
B3F-31XX = drill 1.016 octagon: 1 -2.261,-1.245; 2 2.261,-1.245 | drill 1.499 pad 2.159: 3 -3.505,1.245; 4 3.505,1.245
S03P = drill 1.016 long: 1 2.5,0; 2 0,0; 3 -2.5,0
MICROBUILDER_0805_NOTHERMALS = smd 1.3 x 1.5: 1 -0.95,0; 2 0.95,0
SOIC127P1030X265-18N = smd 1.981 x 0.559: 1 -4.674,5.08; 2 -4.674,3.81; 3 -4.674,2.54; 4 -4.674,1.27; 5 -4.674,0; 6 -4.674,-1.27; 7 -4.674,-2.54; 8 -4.674,-3.81; 9 -4.674,-5.08; 10 4.674,-5.08; 11 4.674,-3.81; 12 4.674,-2.54; 13 4.674,-1.27; 14 4.674,0; 15 4.674,1.27; 16 4.674,2.54; 17 4.674,3.81; 18 4.674,5.08
RJ45 = drill 0.8: G+ 5.84,-6.305; G- 5.84,-3.765; GND -8.57,4.76; NC -6.03,3.5; P4 -8.57,-0.32; P5 -6.03,0.96; RD+ -6.03,-1.58; RD- -8.57,2.22; TD+ -6.03,-4.12; TD- -8.57,-2.86; Y+ 5.84,6.945; Y- 5.84,4.405 | drill 1.4: SHIELD1 -2.73,-7.425; SHIELD2 -2.73,8.065 | hole 3.5: 0.3,-5.38; 0.3,6.02
ESP01 = drill 0.8: CH_PD -1.285,-8.178; GPIO0 1.255,-5.638; GPIO2 -1.285,-5.638; RST 1.255,-8.178; TX -3.825,-8.178; VCC 3.795,-8.178 | drill 0.8 square: GND -3.825,-5.638; RX 3.795,-5.638
MC10 = drill 1.27 long: 1 -17.145,0; 2 -13.335,0; 3 -9.525,0; 4 -5.715,0; 5 -1.905,0; 6 1.905,0; 7 5.715,0; 8 9.525,0; 9 13.335,0; 10 17.145,0
MC2 = drill 1.27 long: 1 -1.905,0; 2 1.905,0

### Placement (x,y rotation side)
BL  66.64,90.13 0 top
BLS  53.13,92.13 90 top
C1  59.63,79.39 0 top
C2  59.63,82.14 0 top
C3  55.63,79.39 0 top
D1  22.39,57.88 180 top
D2  18.39,57.88 180 top
D3  22.39,63.63 180 top
D4  18.39,63.63 180 top
EC1  58.88,37.13 0 top
EC2  58.88,39.63 0 top
EC3  51.88,47.13 0 top
EC4  56.13,32.38 180 top
EC5  56.13,29.63 180 top
EC6  40.88,90.88 180 top
EL1  62.88,38.38 270 top
ENC  52.13,38.63 270 top
ER1  49.38,31.13 180 top
ER2  46.38,31.88 270 top
ER3  56.88,47.63 180 top
ER4  56.88,45.38 180 top
ER10  52.88,31.13 0 top
ERN1  61.13,32.88 270 top
GPIO  19.3,27.81 90 top
INDL  74.89,25.38 270 top
MC  65.89,73.39 135 top
NIR2  75.89,74.13 270 top
NIR3  75.89,86.63 270 top
OD1  14.38,91.63 180 top
OD2  31.89,90.63 0 top
OF1  12.13,83.63 0 top
OF2  12.13,79.88 0 top
OF3  12.13,76.13 0 top
OF4  12.13,72.38 0 top
OF5  12.13,68.63 0 top
OF6  12.13,64.88 0 top
OF7  12.13,61.13 0 top
OF8  12.13,57.38 0 top
OK3  40.13,80.88 0 top
OK4  40.38,66.63 0 top
OL1  31.39,83.88 90 top
OL2  31.39,80.13 90 top
OL3  31.39,76.38 90 top
OL4  31.39,72.38 90 top
OL5  31.39,68.38 90 top
OL6  31.39,64.38 90 top
OL7  31.39,60.38 90 top
OL8  31.39,56.38 90 top
OMF  23.39,90.63 180 top
OR1  18.39,49.15 180 top
OR2  49.39,76.84 270 top
OR3  49.39,82.84 270 top
OR4  23.89,49.15 180 top
OR5  49.39,70.84 270 top
OR6  49.39,64.84 270 top
OR7  11.56,49.15 180 top
OR8  30.86,49.15 180 top
PC1  41.38,22.13 180 top
PC2  61.88,20.63 0 top
PCO  41.88,8.88 90 top
PD1  68.64,4.38 180 top
PD2  51.88,21.63 270 top
PF1  68.89,8.63 0 top
PIC33  56.38,8.38 270 top
PJ1  82.64,10.13 180 top
PL  74.89,21.38 270 top
PP  72.89,51.38 90 top
PR1  70.89,21.38 180 top
Q1  72.14,68.39 45 top
Q2  61.63,43.63 0 top
R1  55.63,75.38 180 top
R2  55.63,82.14 180 top
R3  55.63,72.63 180 top
R6  70.89,25.38 0 top
SR  80.89,23.38 90 top
SV2  80.39,75.38 270 top
SV3  80.39,87.88 270 top
THM  12.32,12.95 90 top
TR  55.5,84.96 0 top
U1  22.64,74.13 180 top
U$1  [IOTECH_COPPER_W_TEXT]  16.14,6.13 0 top
U$2  75.64,36.13 0 top
U$4  [IOTECH_COPPER_W_TEXT]  16.39,6.13 0 bottom
WIFI  66.64,70.13 0 top
XO  5.63,74.38 270 top
XV  5.63,49.38 270 top

### Tracks (layer width: path | path; a pad name or v marks a point on that pad's centre or on a via)
+3V3  (via drill 0.35)
  Top 0.254: WIFI.CH_PD 65.41,62.05 66.54,62.05 67.45,62.97 69.5,62.97 70.42,62.05 WIFI.VCC | NIR2.2 75.92,73.17 80.11,73.17 80.31,72.97 SV2.1 | NIR3.2 75.92,85.72 80.01,85.72 80.31,85.42 SV3.1 | 54.6,36.64 54.6,34.7 54.8,34.49 55.72,34.49 ENC.15 | 54.6,36.64 54.9,36.94 55.72,36.94 ENC.19 55.82,37.04 55.82,37.55 ENC.20 | 56.69,42.71 56.64,42.76 55.82,42.76 ENC.28 | 56.69,42.71 56.94,42.45 56.94,41.23 56.64,40.92 55.82,40.92 ENC.25 55.72,40.82 54.9,40.82 v54.39,40.31 | 69.19,21.33 66.74,21.33 66.13,20.72 PC2.+ | 69.19,21.33 69.9,21.33 PR1.2 | 68.07,36.84 68.37,36.84 69.6,35.62 70.01,35.62 70.62,35 70.62,27.76 69.19,26.33 69.19,21.33 | 68.07,36.84 67.15,36.84 64.8,39.19 62.97,39.19 EL1.1 | 56.69,42.71 58.58,44.6 58.58,45.41 59.29,46.13 64.6,46.13 | 64.6,46.13 64.7,46.13 68.07,42.76 68.07,36.84 | v54.39,36.74 54.49,36.64 54.6,36.64 | PIC33.4 50.62,6.63 51.94,6.63 53.07,5.51 53.07,4.9 51.74,3.57 46.84,3.57 44.7,5.71 40.72,5.71 37.66,8.78 PCO.P$1 37.55,8.98 37.55,13.37 34.7,16.23 34.7,30.92 | 48.07,31.02 48.37,31.02 ER1.2 | 48.07,31.02 46.43,31.02 ER2.2 46.33,30.92 34.7,30.92 | THM.1 12.35,12.04 15,14.7 15,20.61 19.39,25 19.39,26.64 20.51,27.76 GPIO.3 20.61,27.86 23.68,30.92 34.7,30.92 | 48.07,31.02 v48.07,32.35 | 64.6,46.13 v64.6,46.53
  Bottom 0.254: BLS.1 57.05,92.15 62.56,92.15 63.48,93.07 72.66,93.07 80.31,85.42 SV3.1 80.42,85.31 82.25,83.48 82.25,74.8 80.42,72.97 SV2.1 80.42,72.76 80.42,72.46 70.52,62.56 70.52,62.05 WIFI.VCC | v54.39,40.31 v54.39,36.74 52.45,36.74 v48.07,32.35 | v64.6,46.53 65.31,47.25 65.31,61.94 WIFI.CH_PD
A0
  Top 0.203: SV3.2 80.31,87.86 80.01,87.56 75.92,87.56 NIR3.1 75.82,87.46 75.52,87.15 64.5,87.15 63.07,85.72 63.07,83.17 61.13,81.23 60.92,81.23 59.8,80.11 59.8,76.84 61.43,75.21 MC.23
A1  (via drill 0.35)
  Top 0.203: 17.2,47.5 17.96,48.27 17.96,48.47 OR1.6 | 17.2,47.5 16.74,47.05 12.35,47.05 11.23,48.17 11.23,48.47 OR7.6 | v62.66,74.39 62.25,73.99 61.54,73.99 61.13,74.39 60.92,74.39 MC.24 | v59.19,75.01 59.19,71.23 v53.37,65.41 | v37.76,49.8 37.35,49.8 32.55,45 19.7,45 17.2,47.5
  Bottom 0.203: v62.66,74.39 62.25,74.39 61.64,75.01 v59.19,75.01 | v37.76,49.8 v53.37,65.41
A2  (via drill 0.35)
  Top 0.203: 33.93,46.99 49.19,62.25 51.23,62.25 59.19,70.21 59.19,70.62 60.82,72.25 MC.25 | 33.93,46.99 32.35,45.41 25.51,45.41 22.76,48.17 22.76,48.47 OR4.5 | v28.78,47.96 29.29,48.47 29.59,48.47 OR8.5 | 33.93,46.99 v32.96,47.96
  Bottom 0.203: v32.96,47.96 v28.78,47.96
A3  (via drill 0.35)
  Top 0.203: 29.9,47.25 29.9,47.66 30.41,48.17 30.41,48.47 OR8.6 | 29.9,47.25 29.9,46.53 29.19,45.82 25.92,45.82 23.57,48.17 23.57,48.47 OR4.6 | v59.9,70.21 61.43,71.74 MC.26 | v28.78,48.98 28.06,48.27 28.06,47.66 28.47,47.25 29.9,47.25
  Bottom 0.203: v59.9,70.21 53.68,70.21 32.45,48.98 v28.78,48.98
A4  (via drill 0.35)
  Top 0.203: v58.27,73.58 56.54,75.31 R1.1 | v62.45,72.56 62.45,71.64 62.05,71.23 MC.27
  Bottom 0.203: v62.45,72.56 61.43,73.58 v58.27,73.58 56.43,73.58 47.45,64.6 43.37,64.6 19.49,40.72 19.49,27.35 20.51,26.33 20.51,25.31 GPIO.1
A5  (via drill 0.35)
  Top 0.203: v58.48,72.56 56.54,72.56 R3.1 | v61.23,70.21 62.15,70.21 62.56,70.62 MC.28 | v59.7,68.78 46.02,55.11 46.02,48.07 42.15,44.19 32.35,44.19 19.49,31.33 19.49,27.76 18.06,26.33 18.06,25.31 GPIO.2
  Bottom 0.203: v58.48,72.56 58.88,72.56 v61.23,70.21 61.13,70.21 v59.7,68.78
A6  (via drill 0.35)
  Top 0.203: 10.46,52.1 11.43,53.07 12.65,53.07 17.14,48.58 OR1.5 | 10.46,52.1 9.7,51.33 9.7,49.39 10.31,48.78 10.31,48.58 OR7.5 | v62.86,78.17 63.68,77.35 MC.19 | v14.23,81.56 13.8,81.13 12.55,81.13 11.94,80.52 11.94,55.72 9.7,53.47 9.7,52.86 10.46,52.1
  Bottom 0.203: v62.86,78.17 62.86,77.25 61.43,75.82 57.15,75.82 47.45,85.52 23.27,85.52 18.37,80.62 15.17,80.62 v14.23,81.56
A7  (via drill 0.35)
  Top 0.203: v57.45,84.91 56.43,84.91 TR.2 | v61.13,76.54 62.05,75.62 MC.22 | v12.35,82.25 5,82.25 3.37,80.62 3.37,56.74 7.86,52.25 7.86,50.01 12.25,45.62 12.25,13.98 THM.2
  Bottom 0.203: v61.13,76.54 59.39,76.54 57.45,78.48 v57.45,84.91 56.43,85.93 16.02,85.93 v12.35,82.25
AREF
  Top 0.203: C1.2 60.62,79.29 63.17,76.74 MC.20
BLV  (via drill 0.35)
  Top 0.203: R3.2 54.8,72.66 54.8,75.31 R1.2 54.8,75.42 54.8,76.13 v55.31,76.64 | v54.29,77.66 54.29,78.89 54.7,79.29 C3.1 54.8,79.39 54.8,82.05 R2.2 54.7,82.15 49.39,87.46 49.39,91.13 | 49.39,91.13 49.39,92.05 BLS.2 | 68.73,71.59 68.78,71.64 69.29,71.64 69.7,71.23 MC.6 | 68.73,71.59 68.17,71.03 68.17,70.82 68.58,70.42 68.58,70.11 MC.4 | v63.78,85.42 63.78,78.58 64.19,78.17 64.19,77.86 MC.18 64.29,77.76 v67.66,74.39 | v67.66,72.66 68.73,71.59 | 49.39,91.13 63.88,91.13 64.09,91.33 BL.2
  Bottom 0.203: v54.29,77.66 v55.31,76.64 | v63.78,85.42 63.78,86.95 65.21,88.38 65.21,90.31 64.19,91.33 BL.2 | v67.66,74.39 v67.66,72.66
D2  (via drill 0.35)
  Top 0.203: v61.84,55.92 61.84,65.31 64.8,68.27 MC.32 | v49.9,41.53 49.29,40.92 48.58,40.92 ENC.4
  Bottom 0.203: v61.84,55.92 61.84,55.62 49.9,43.68 v49.9,41.53
D3
  Top 0.203: MC.1 66.84,68.27 66.84,67.66 63.78,64.6 63.78,62.97 62.86,62.05 WIFI.TX
D4
  Top 0.203: MC.2 67.56,68.88 67.56,68.68 70.42,65.82 70.42,64.5 WIFI.RX
D5  (via drill 0.35)
  Top 0.203: v27.35,47.55 26.43,48.47 25.1,48.47 OR4.8 | v31.33,47.25 31.33,47.55 32.04,48.27 32.04,48.47 OR8.8 | v69.5,74.09 69.6,73.99 70.21,73.99 70.62,74.39 70.82,74.39 MC.9
  Bottom 0.203: v27.35,47.55 28.17,47.55 28.47,47.25 v31.33,47.25 36.23,47.25 54.49,65.52 65.72,65.52 66.33,64.9 66.33,64.6 67.45,63.48 68.27,63.48 68.88,64.09 68.88,64.7 69.5,65.31 v69.5,74.09
D6  (via drill 0.35)
  Top 0.203: v28.88,46.53 26.02,46.53 24.29,48.27 24.29,48.47 OR4.7 | v30.61,46.53 30.61,47.66 31.23,48.27 31.23,48.47 OR8.7 | v78.27,39.09 80.72,41.53 81.33,41.53 82.46,42.66 82.46,64.29 71.33,75.42 71.03,75.42 70.62,75.01 70.42,75.01 MC.10 | v46.02,37.25 38.88,37.25 v32.66,43.47
  Bottom 0.203: v28.88,46.53 v30.61,46.53 32.66,44.49 v32.66,43.47 | v78.27,39.09 71.54,39.09 70.01,40.62 68.17,40.62 67.45,39.9 55.82,39.9 54.7,41.02 51.74,41.02 49.6,38.88 46.84,38.88 46.02,38.06 v46.02,37.25
D7  (via drill 0.35)
  Top 0.203: v16.23,48.47 12.86,48.47 OR7.8 | v19.29,47.55 19.29,47.96 19.49,48.17 19.49,48.47 OR1.8 | v68.78,74.8 69.5,75.52 69.7,75.52 MC.11 | v68.78,65.62 68.78,65.01 68.88,64.9 68.88,64.09 68.27,63.48 66.74,63.48 v66.23,62.97 | v40.31,49.09 37.25,49.09 32.76,44.6 19.08,44.6 v17.96,45.72
  Bottom 0.203: v16.23,48.47 18.37,48.47 v19.29,47.55 17.96,46.23 v17.96,45.72 | v68.78,65.62 v68.78,74.8 | v66.23,62.97 65.01,62.97 63.78,61.74 63.78,61.54 51.33,49.09 v40.31,49.09
D8  (via drill 0.35)
  Top 0.203: v15.51,47.76 12.45,47.76 12.04,48.17 12.04,48.47 OR7.7 | v18.27,47.55 18.27,47.76 18.78,48.27 18.78,48.47 OR1.7 | v82.25,73.78 82.05,73.99 75.42,73.99 72.86,76.54 69.9,76.54 69.6,76.23 69.29,76.23 MC.12
  Bottom 0.203: v18.27,47.55 18.06,47.76 v15.51,47.76 12.35,47.76 3.37,56.74 3.37,88.27 4.08,88.99 5.92,88.99 10.51,93.58 72.86,93.58 77.15,89.29 81.33,89.29 82.76,87.86 82.76,74.6 82.25,74.09 v82.25,73.78
D9
  Top 0.203: SV2.2 80.31,75.31 80.11,75.11 75.92,75.11 NIR2.1 75.82,75.11 73.78,77.15 69.29,77.15 68.88,76.74 68.68,76.74 MC.13
D10  (via drill 0.35)
  Top 0.203: 47.2,37.09 47.66,37.55 48.47,37.55 ENC.9 | 47.2,37.09 46.43,36.33 46.43,32.86 ER2.1 | v66.94,76.13 68.07,77.25 MC.14 | v65.11,69.9 v66.94,71.74 | v60.82,66.23 60.82,65.82 46.43,51.43 46.43,37.86 47.2,37.09
  Bottom 0.203: v66.94,71.74 v66.94,76.13 | v65.11,69.9 64.5,69.9 v60.82,66.23
D11  (via drill 0.35)
  Top 0.203: v70.72,81.03 67.56,77.86 MC.15 | v70.72,87.86 70.72,88.89 69.29,90.31 67.66,90.31 66.64,91.33 BL.4 | v66.03,51.33 52.56,51.33 47.45,46.23 47.45,39.19 47.66,38.98 48.47,38.98 ENC.7 | v73.17,66.23 v73.17,64.19
  Bottom 0.203: v70.72,87.86 v70.72,81.03 73.17,78.58 v73.17,66.23 | v66.03,51.33 66.03,56.13 71.64,61.74 71.64,62.66 v73.17,64.19
D12  (via drill 0.35)
  Top 0.203: v69.9,86.44 69.9,82.15 66.94,79.19 66.94,78.48 MC.16 | v51.02,41.33 49.39,39.7 48.58,39.7 ENC.6 | v72.35,65.62 v72.35,61.84
  Bottom 0.203: BL.1 64.09,88.89 62.97,90.01 62.97,91.84 63.68,92.56 69.6,92.56 70.31,91.84 70.31,88.48 69.9,88.07 v69.9,86.44 69.9,80.82 72.35,78.37 v72.35,65.62 | v51.02,41.33 51.02,44.19 54.6,47.76 62.35,47.76 64.29,45.82 64.9,45.82 71.03,51.94 71.03,60.52 v72.35,61.84
D13  (via drill 0.35)
  Top 0.203: v64.6,86.23 64.6,82.46 64.8,82.25 64.8,78.48 MC.17 64.9,78.37 v66.33,76.95 | v71.33,27.76 70.01,26.43 70.01,25.41 R6.1 | v47.15,38.17 48.37,38.17 48.47,38.27 ENC.8 | v78.99,66.13 v71.64,73.48
  Bottom 0.203: v64.6,86.23 64.6,86.84 66.54,88.78 BL.3 | v47.15,38.17 47.15,32.25 51.64,27.76 v71.33,27.76 71.33,30.41 78.99,38.06 v78.99,66.13 | v66.33,76.95 68.17,76.95 v71.64,73.48
DTR
  Top 0.203: C2.2 60.52,82.05 60.11,82.05 58.37,80.31 58.17,80.31 57.96,80.11 57.96,77.25 59.9,75.31 59.9,74.5 61.03,73.37 70.72,73.37 74.19,69.9 74.19,56.43 72.97,55.21 PP.1
EP4
  Top 0.203: ERN1.7 61.84,33.37 61.84,33.98 ERN1.8 61.84,34.09 61.84,34.7 | 61.84,34.7 61.84,36.43 62.86,37.45 EL1.2 62.97,37.45 64.6,35.82 67.05,35.82 U$2.P4 | 61.84,34.7 59.29,34.7 58.88,34.29 58.88,34.19 58.27,33.57 58.17,33.57 57.05,32.45 EC4.1
EP5  (via drill 0.35)
  Top 0.203: ERN1.4 60.52,31.74 60.52,32.45 ERN1.3 60.41,32.55 v59.6,32.55 | v58.68,31.33 57.05,29.7 EC5.1
  Bottom 0.203: U$2.P5 69.6,37.04 66.84,37.04 62.35,32.55 v59.6,32.55 58.68,31.64 v58.68,31.33
GND  (via drill 0.35)
  Top 0.254: v52.35,5.21 52.15,5 50.62,5 PIC33.5 | v52.35,7.25 52.15,7.25 51.02,8.37 50.62,8.37 PIC33.3 | ER10.2 53.88,31.12 55.31,29.7 EC5.2 55.31,29.59 55.31,25.41 | 55.31,25.41 55.31,23.06 55.41,22.96 | 55.41,22.96 57.66,20.72 PC2.- 57.76,20.51 62.25,20.51 63.78,18.98 73.48,18.98 75.82,21.33 PL.C | 55.41,22.96 51.94,19.49 PD2.A 51.94,19.39 52.35,18.98 v52.35,17.55 | 55.31,25.41 50.52,25.41 47.25,22.14 45.62,22.14 PC1.- | 81.44,38.37 81.44,32.45 U$2.G- | 81.44,38.37 81.44,40.51 U$2.Y- 81.54,40.62 81.54,41.02 82.97,42.45 82.97,75.21 80.42,77.76 SV2.3 80.42,77.97 80.42,83.07 82.25,84.91 82.25,88.48 80.42,90.31 SV3.3 80.31,90.42 70.31,90.42 69.29,91.44 BL.6 69.09,91.44 67.97,92.56 66.23,92.56 65.52,91.84 65.52,91.23 64.5,90.21 63.88,90.21 57.66,83.99 55.52,83.99 | PL.C 75.92,21.43 75.92,25.31 INDL.C | INDL.C 75.82,25.41 75.82,25.82 72.97,28.68 U$2.SHIELD1 | PJ1.GND 82.56,15.92 81.44,15.92 76.03,21.33 PL.C | SR.2 82.05,25.61 80.52,25.61 80.31,25.41 76.03,25.41 INDL.C | 56.64,36.33 56.84,36.13 58.48,36.13 59.39,37.04 59.7,37.04 EC1.2 59.8,37.25 59.8,37.45 61.94,39.59 61.94,39.9 62.97,40.92 66.94,40.92 U$2.GND 67.05,40.92 67.05,43.06 64.5,45.62 62.45,45.62 62.25,45.41 62.25,43.06 59.8,40.62 59.8,39.7 EC2.2 | 56.64,36.33 55.82,36.33 ENC.18 | 53.68,36.33 53.68,37.04 54.9,38.27 55.01,38.27 | 53.68,36.33 53.68,34.9 55.21,33.37 55.21,32.45 EC4.2 | 55.01,38.27 55.72,38.27 ENC.21 | 53.68,36.33 48.58,36.33 ENC.11 | ENC.22 55.82,38.88 55.82,38.37 ENC.21 | ENC.2 48.58,42.25 51.13,42.25 55.01,38.37 55.01,38.27 | 56.64,36.33 56.64,36.43 56.94,36.74 56.94,37.96 56.54,38.37 55.92,38.37 ENC.21
  Top 0.254: 68.99,69.09 69.09,69.09 69.7,69.7 69.7,70.21 69.29,70.62 MC.5 | 68.99,69.09 68.58,69.09 68.17,69.5 MC.3 67.97,69.5 67.45,70.01 67.15,70.01 65.92,68.78 65.92,68.58 62.86,65.52 62.86,64.5 WIFI.GND | 71.64,66.33 72.25,66.33 72.86,66.94 72.86,67.56 Q1.2 | 71.64,66.33 68.99,68.99 68.99,69.09 | v54.9,47.05 53.37,47.05 EC3.- | 71.64,66.33 71.64,56.33 71.03,55.72 71.03,54.49 72.86,52.66 PP.2 | 81.44,38.37 75.42,38.37 72.86,40.92 72.86,44.19 U$2.SHIELD2 | 55.52,83.99 55.52,84.09 54.7,84.91 TR.1 | 55.52,83.99 55.52,81.64 56.43,80.72 56.43,79.39 C3.2 56.43,79.29 56.43,78.78 52.66,75.01 52.66,65.21 50.21,62.76 45.51,62.76 44.29,61.54 39.7,61.54 38.17,63.07 38.06,63.07 | v58.78,78.17 58.78,79.29 C1.1 | v60.62,78.17 62.56,76.23 MC.21 | 33.62,73.22 33.47,73.37 31.33,73.37 30.41,72.46 OL4.C | 33.62,73.22 37.04,69.8 OK4.2 37.25,69.8 37.55,69.8 v38.17,69.19 | 30.41,82.35 30.41,83.78 OL1.C | 30.41,82.35 30.41,80.21 OL2.C | v38.06,77.56 36.94,76.44 OK3.8 | OK3.6 36.94,78.99 v38.06,78.99 37.76,79.09 37.76,80.62 36.94,81.44 OK3.4 36.84,81.54 36.02,82.35 | 36.02,82.35 36.02,83.17 36.84,83.99 OK3.2 | v35.31,77.56 31.94,77.56 30.82,76.44 30.41,76.44 OL3.C | 36.02,82.35 30.41,82.35 | v35.31,74.91 33.62,73.22 | 38.06,63.07 37.86,62.86 37.76,62.86 37.15,62.25 OK4.8 | 38.06,63.07 38.06,63.78 37.15,64.7 OK4.6 | OK4.4 38.06,66.33 38.06,65.52 37.25,64.7 OK4.6 | v30.31,57.66 30.31,56.43 OL8.C | v30.31,59.19 30.31,60.31 OL7.C 30.41,60.41 30.41,64.29 OL6.C 30.31,64.5 30.31,65.31 | 30.31,65.31 30.31,68.37 OL5.C | 30.31,65.31 33.27,65.31 33.78,64.8 37.04,64.8 OK4.6
  Bottom 0.254: v52.35,5.21 v52.35,7.25 v52.35,17.55 | U$2.G- 81.54,32.35 81.54,31.23 82.56,30.21 82.56,26.12 82.15,25.72 SR.2 | 71.03,46.13 71.03,50.72 72.86,52.56 PP.2 | 71.03,46.13 72.86,44.29 U$2.SHIELD2 | v54.9,47.05 60.92,47.05 66.38,41.59 | 66.38,41.59 67.05,40.92 U$2.GND | 66.38,41.59 70.92,46.13 71.03,46.13 | BL.6 69.09,91.33 68.07,90.31 68.07,88.68 58.78,79.39 v58.78,78.17 v60.62,78.17 | v38.06,78.99 v38.06,77.56 v35.31,77.56 v35.31,74.91 | 7.96,45 7.96,48.98 5.71,51.23 XV.1 | 7.96,45 7.96,38.88 17.96,28.88 17.96,27.86 GPIO.4 | 7.96,45 18.27,45 30.31,57.05 v30.31,57.66 v30.31,59.19 30.31,65.82 31.43,66.94 35,66.94 37.25,69.19 v38.17,69.19
  pour Top (isolate 0.305): -0.38,96.9 84.96,96.9 84.96,-0.64 -0.38,-0.64
  pour Bottom (isolate 0.305): -0.51,96.9 84.84,96.9 84.84,-0.64 -0.51,-0.64
  cutout Top: 8.76,18.16 15.62,18.16 15.62,8.64 8.76,8.64
  cutout Bottom: 8.76,18.16 15.62,18.16 15.62,8.64 8.76,8.64
GNDO  (via drill 0.35)
  Top 0.254: v23.68,79.29 27.25,79.29 U1.9 | OR6.5 50.01,63.68 50.01,64.39 OR6.6 50.01,64.5 50.01,65.21 OR6.7 50.01,65.31 50.01,66.03 OR6.8 50.11,66.13 50.11,67.97 52.15,70.01 52.15,73.37 50.01,75.52 OR2.5 50.01,75.72 OR2.6 50.01,76.54 50.01,77.15 OR2.7 50.01,77.35 50.01,77.97 OR2.8 50.01,78.17 51.23,79.39 51.23,84.6 43.37,92.46 41.43,92.46 39.9,90.93 39.49,90.93 EC6.- 39.29,90.83 39.19,90.72 34.19,90.72 OD2.A 33.98,90.62 32.35,92.25 24.19,92.25 23.57,91.64 23.57,90.01 21.33,87.76 5.71,87.76 XO.2
  Bottom 0.254: v23.68,79.29 14.08,79.29 5.71,87.66 XO.2
IO5  (via drill 0.35)
  Top 0.203: 42.81,71.49 42.76,71.44 42.76,70.62 43.58,69.8 OK4.15 | 42.81,71.49 43.98,72.66 51.23,72.66 51.64,72.25 51.64,70.21 48.78,67.35 48.78,66.13 OR6.1 | v29.08,72.35 28.68,72.76 27.35,72.76 U1.4 | 42.81,71.49 v41.64,72.66
  Bottom 0.203: v29.08,72.35 32.66,72.35 32.96,72.66 v41.64,72.66
IO6  (via drill 0.35)
  Top 0.203: v46.53,65.31 48.68,65.31 OR6.2 | v44.8,67.05 43.88,67.05 43.68,67.25 OK4.13 43.58,67.35 v37.55,73.37 | v28.98,71.33 28.78,71.54 27.35,71.54 U1.3
  Bottom 0.203: v44.8,67.05 v46.53,65.31 | v28.98,71.33 28.37,71.94 28.37,72.66 29.08,73.37 v37.55,73.37
IO7  (via drill 0.35)
  Top 0.203: OR6.3 48.68,64.39 45.82,64.39 44.29,62.86 42.96,62.86 42.76,63.07 42.76,63.88 43.58,64.7 OK4.11 43.58,64.8 v42.05,66.33 | v35.51,70.31 27.35,70.31 U1.2
  Bottom 0.203: v35.51,70.31 38.06,70.31 v42.05,66.33
IO8
  Top 0.203: OR6.4 48.68,63.58 45.62,63.58 44.29,62.25 43.68,62.25 OK4.9 43.58,62.25 42.96,62.25 42.35,62.86 42.35,63.27 37.76,67.86 36.13,67.86 34.29,69.7 29.39,69.7 28.78,69.09 27.35,69.09 U1.1
LEDA
  Top 0.203: ER3.1 57.86,47.66 70.52,47.66 72.56,45.62 78.99,45.62 81.44,43.17 U$2.Y+
LEDB
  Top 0.203: ER4.1 57.86,45.41 59.7,47.25 64.9,47.25 81.44,30.72 81.44,29.9 U$2.G+
N$1
  Top 0.203: OD1.A 12.14,91.54 5.71,91.54 XO.1
N$2
  Top 0.203: PD1.C 66.44,4.39 66.44,8.57 PF1.1
N$4
  Top 0.203: OMF.2 21.94,90.72 17.45,90.72 16.63,91.54 OD1.C
N$5
  Top 0.203: R6.2 71.84,25.41 73.78,25.41 INDL.A
N$6
  Top 0.203: OF8.1 10.71,57.35 5.82,57.35 5.71,57.25 XO.10
N$7
  Top 0.203: D1.1 23.27,58.88 23.27,59.7 20.51,62.45 20.51,68.37 18.57,70.31 18.06,70.31 U1.17 18.68,70.31 19.29,70.92 19.29,72.05 19.08,72.25 16.84,72.25 16.63,72.05 16.63,71.94 14.8,70.11 12.86,70.11 12.35,69.6 12.35,63.88 13.47,62.76 13.47,61.13 OF7.2
N$8
  Top 0.203: OR1.4 17.25,49.8 17.25,51.02 21.84,55.62 23.06,55.62 25,57.56 25,76.95 22.96,78.99 22.96,79.6 28.68,85.31 36.84,85.31 OK3.1
N$9
  Top 0.203: ER3.2 55.92,47.55 55.92,46.84 54.7,45.62 54.7,42.45 54.9,42.25 55.72,42.25 ENC.27
N$10  (1 unrouted)
  Top 0.203: MC.8 70.92,72.25 70.92,72.05 72.15,70.82 72.15,70.01 72.27,69.95
N$11
  Top 0.203: PR1.1 71.84,21.43 73.78,21.43 PL.A
N$13
  Top 0.203: ENC.1 48.58,42.86 48.58,45.21 50.41,47.05 EC3.+
N$14
  Top 0.203: ER4.2 56.02,45.41 56.02,46.23 56.74,46.94 56.74,48.37 56.54,48.58 52.66,48.58 51.94,47.86 51.94,44.6 54.9,41.64 55.72,41.64 ENC.26
N$15  (1 unrouted)
  Top 0.203: MC.7 70.42,71.74 70.42,71.44 70.82,71.03 70.82,68.58 70.62,68.37 70.57,68.25
N$16
  Top 0.203: 48.52,14.13 48.47,14.19 47.55,14.19 46.23,12.86 46.23,8.88 PCO.P$2 | 48.52,14.13 49.19,13.47 49.19,11.12 50.21,10.1 50.52,10.1 PIC33.2 | PD2.C 51.84,23.78 51.84,22.25 48.58,18.98 48.58,14.19 48.52,14.13
N$17
  Top 0.203: ER1.1 50.21,31.23 47.45,33.98 47.45,36.74 47.66,36.94 48.47,36.94 ENC.10
N$19
  Top 0.203: ER10.1 51.94,31.23 51.74,31.23 48.58,34.39 ENC.14
N$22
  Top 0.203: ENC.24 55.82,40.21 56.64,40.21 57.15,39.7 57.96,39.7 EC2.1 57.96,39.8 57.96,41.84 59.7,43.58 Q2.1
N$24
  Top 0.203: 57.91,38.22 56.54,39.59 55.82,39.59 ENC.23 | 57.91,38.22 57.96,38.17 57.96,37.15 EC1.1 | 57.91,38.22 57.96,38.27 59.9,38.27 61.43,39.8 61.43,41.53 63.48,43.58 Q2.2
N$35  (via drill 0.35)
  Top 0.203: v17.96,50.72 17.96,49.8 OR1.3 | v21.53,76.54 21.53,79.39 28.47,86.33 37.76,86.33 38.17,85.93 38.17,84.09 36.94,82.86 OK3.3
  Bottom 0.203: v17.96,50.72 12.96,50.72 12.55,51.13 12.55,51.94 18.68,58.07 18.68,64.29 21.53,67.15 v21.53,76.54
N$45  (via drill 0.35)
  Top 0.203: v26.64,68.17 26.64,57.56 22.14,53.07 21.84,53.07 18.88,50.11 18.88,49.8 OR1.2 | v35.72,78.99 36.94,80.21 OK3.5
  Bottom 0.203: v26.64,68.17 26.64,71.54 31.43,76.33 33.06,76.33 v35.72,78.99
N$46  (via drill 0.35)
  Top 0.203: v21.84,52.05 19.59,49.8 OR1.1 | v21.84,53.78 25.92,57.86 25.92,74.5 26.23,74.8 33.57,74.8 36.43,77.66 36.84,77.66 OK3.7
  Bottom 0.203: v21.84,53.78 v21.84,52.05
N$47
  Top 0.203: 20.56,58.73 19.59,57.76 13.88,57.76 13.57,57.45 OF8.2 | 20.56,58.73 20.61,58.78 21.43,58.78 D1.2 | 20.56,58.73 20.1,59.19 20.1,68.17 19.29,68.99 18.06,68.99 U1.18
N$48
  Top 0.203: OR3.1 48.68,84.09 44.7,84.09 43.47,85.31 OK3.16
N$49
  Top 0.203: D2.2 17.35,58.88 17.35,61.03 13.57,64.8 OF6.2 13.57,64.9 14.7,66.03 14.7,68.78 17.45,71.54 17.96,71.54 U1.16
N$50  (via drill 0.35)
  Top 0.203: v15,64.6 19.29,60.31 19.29,58.88 D2.1 | v13.98,67.05 13.98,68.17 13.57,68.58 OF5.2 | v14.49,70.82 16.43,72.76 17.96,72.76 U1.15
  Bottom 0.203: v15,64.6 15,66.03 v13.98,67.05 14.08,67.05 14.49,67.45 v14.49,70.82
N$51
  Top 0.203: OF7.1 10.71,61.13 5.71,61.13 XO.9
N$52
  Top 0.203: OF6.1 10.71,64.9 5.71,64.9 XO.8
N$53
  Top 0.203: OR3.2 48.68,83.17 43.78,83.17 43.47,82.86 OK3.14
N$54
  Top 0.203: OF5.1 10.71,68.68 5.71,68.68 XO.7
N$55
  Top 0.203: OF4.1 10.71,72.46 5.71,72.46 XO.6
N$56
  Top 0.203: OR3.3 48.68,82.35 46.84,82.35 44.7,80.21 43.47,80.21 OK3.12
N$57
  Top 0.203: D3.1 23.27,64.7 23.27,70.62 18.57,75.31 18.06,75.31 U1.13 17.86,75.42 17.25,76.03 13.57,76.03 OF3.2
N$58
  Top 0.203: OR3.4 48.68,81.64 46.94,81.64 44.19,78.89 44.19,78.48 43.47,77.76 OK3.10
N$59  (via drill 0.35)
  Top 0.203: v18.57,65.82 17.45,64.7 D4.2 | v20,75.11 18.47,76.64 18.06,76.64 U1.12 17.96,76.74 17.45,76.74 14.39,79.8 13.57,79.8 OF2.2
  Bottom 0.203: v18.57,65.82 18.57,66.23 20,67.66 v20,75.11
N$60  (via drill 0.35)
  Top 0.203: v10.41,51.02 10.41,49.8 OR7.4 | v10.41,53.17 10.92,53.17 13.78,56.02 22.86,56.02 24.59,57.76 24.59,76.74 22.55,78.78 22.55,79.8 28.68,85.93 37.55,85.93 37.76,85.72 37.76,84.91 37.55,84.7 33.27,84.7 32.45,83.89 OL1.A
  Bottom 0.203: v10.41,53.17 v10.41,51.02
N$61  (via drill 0.35)
  Top 0.203: v11.23,51.64 11.23,49.8 OR7.3 | v29.29,79.09 31.33,79.09 32.35,80.11 OL2.A
  Bottom 0.203: v11.23,51.64 11.23,69.39 20.41,78.58 28.78,78.58 v29.29,79.09
N$62  (via drill 0.35)
  Top 0.203: v11.94,52.35 11.94,49.8 OR7.2 | v29.08,75.62 29.39,75.62 29.59,75.42 31.43,75.42 32.35,76.33 OL3.A
  Bottom 0.203: v11.94,52.35 11.94,58.17 20.82,67.05 20.82,76.84 21.23,77.25 24.19,77.25 25.82,75.62 v29.08,75.62
N$63  (via drill 0.35)
  Top 0.203: v13.27,51.43 12.86,51.02 12.86,49.8 OR7.1 | v33.06,71.03 33.06,71.74 32.45,72.35 OL4.A
  Bottom 0.203: v13.27,51.43 13.47,51.43 v33.06,71.03
N$64  (via drill 0.35)
  Top 0.203: v19.29,67.97 19.29,64.7 D4.1 | v19.59,76.74 18.47,77.86 18.06,77.86 U1.11 17.86,77.97 17.45,77.97 16.63,78.78 16.63,80.13 13.57,83.19 13.57,83.58 OF1.2
  Bottom 0.203: v19.29,67.97 19.29,76.44 v19.59,76.74
N$65
  Top 0.203: D3.2 21.43,64.7 21.43,71.13 18.47,74.09 18.06,74.09 U1.14 17.96,74.09 17.14,74.09 15.51,72.46 13.57,72.46 OF4.2
N$66
  Top 0.203: OF3.1 10.71,76.13 5.82,76.13 5.71,76.23 XO.5
N$67
  Top 0.203: OF2.1 10.71,79.91 5.82,79.91 5.71,80.01 XO.4
N$68
  Top 0.203: OF1.1 10.71,83.68 5.92,83.68 5.71,83.89 XO.3
N$69  (via drill 0.35)
  Top 0.203: v22.76,52.66 22.76,49.8 OR4.4 | v38.27,71.03 37.15,71.03 OK4.1
  Bottom 0.203: v22.76,52.66 22.76,59.6 34.19,71.03 v38.27,71.03
N$70  (via drill 0.35)
  Top 0.203: v23.57,53.47 23.57,49.8 OR4.3 | v36.02,68.99 36.64,68.99 37.04,68.58 OK4.3
  Bottom 0.203: v23.57,53.47 23.57,59.8 32.76,68.99 v36.02,68.99
N$71
  Top 0.203: OR4.2 24.29,49.8 24.29,54.6 29.39,59.7 29.39,69.09 29.59,69.29 33.78,69.29 37.04,66.03 OK4.5
N$72  (via drill 0.35)
  Top 0.203: v26.23,49.8 25.1,49.8 OR4.1 | v36.13,61.54 36.13,62.45 37.04,63.37 OK4.7
  Bottom 0.203: v26.23,49.8 30.41,53.98 30.41,55.82 v36.13,61.54
N$73
  Top 0.203: OR5.1 48.68,71.94 44.49,71.94 43.68,71.13 OK4.16
N$74
  Top 0.203: OR5.2 48.68,71.23 46.33,71.23 43.68,68.58 OK4.14
N$75
  Top 0.203: OR5.3 48.68,70.42 48.47,70.42 45.51,67.45 45.51,66.74 44.8,66.03 43.68,66.03 OK4.12
N$76
  Top 0.203: OR5.4 48.68,69.6 48.68,68.48 43.68,63.48 OK4.10
N$77  (via drill 0.35)
  Top 0.203: v29.7,54.29 29.7,49.8 OR8.4 | OL5.A 33.52,67.3 v33.52,66.1
  Bottom 0.203: v29.7,54.29 29.7,55.72 33.52,59.54 v33.52,66.1
N$78
  Top 0.203: OR8.3 30.41,49.8 30.41,54.6 29.39,55.62 29.39,57.76 30.11,58.48 30.61,58.48 31.43,59.29 31.43,63.37 32.35,64.29 OL6.A
N$79
  Top 0.203: OR8.2 31.33,49.8 31.33,58.58 32.35,59.6 32.35,60.31 OL7.A
N$80
  Top 0.203: OR8.1 32.15,49.8 32.15,56.13 32.35,56.33 OL8.A
OI1  (via drill 0.35)
  Top 0.203: 42.61,84.86 43.37,84.09 OK3.15 | 42.61,84.86 42.55,84.91 42.55,85.72 42.76,85.93 49.19,85.93 50.72,84.39 50.72,80.42 48.78,78.48 48.78,78.07 OR2.1 | v29.19,77.97 27.35,77.97 U1.8 | v39.9,84.8 42.55,84.8 42.61,84.86
  Bottom 0.203: v29.19,77.97 33.06,77.97 v39.9,84.8
OI2  (via drill 0.35)
  Top 0.203: v45.82,79.5 48.07,77.25 48.68,77.25 OR2.2 | v44.39,80.93 43.98,80.93 43.47,81.44 OK3.13 | v25.72,76.74 27.25,76.74 U1.7
  Bottom 0.203: v45.82,79.5 v44.39,80.93 44.39,80.82 36.53,80.82 32.45,76.74 v25.72,76.74
OI3
  Top 0.203: 42.71,78.22 43.37,78.89 OK3.11 | 42.71,78.22 42.55,78.07 42.55,77.25 42.76,77.05 43.98,77.05 44.49,76.54 48.68,76.54 OR2.3 | U1.6 27.35,75.42 27.86,75.42 29.39,76.95 29.39,77.15 30.51,78.27 42.66,78.27 42.71,78.22
OI4
  Top 0.203: OR2.4 48.68,75.72 44.09,75.72 43.47,76.33 OK3.9 43.37,76.33 42.86,75.82 35.21,75.82 33.57,74.19 27.35,74.19 U1.5
RAW_IV  (via drill 0.35)
  Top 0.254: PF1.2 71.33,8.67 71.33,12.96 68.37,15.92 55.31,15.92 51.23,11.84 50.62,11.84 PIC33.1 50.62,11.94 50.01,12.55 v50.01,12.96 | v40.92,22.04 37.25,22.04 PC1.+
  Bottom 0.254: v50.01,12.96 v40.92,22.04
RD+
  Top 0.203: 68.07,34.49 69.6,34.49 U$2.RD+ | 68.07,34.49 66.33,34.49 64.39,32.55 61.84,32.55 ERN1.6 | 68.07,34.49 68.07,32.86 63.88,28.68 56.54,28.68 56.23,28.98 56.23,30.11 55.72,30.61 55.52,30.61 54.49,31.64 54.49,31.94 51.43,35 48.58,35 ENC.13
RD-  (via drill 0.35)
  Top 0.203: v63.17,31.74 61.84,31.74 ERN1.5 | v52.96,35.62 48.58,35.62 ENC.12
  Bottom 0.203: v63.17,31.74 64.09,31.74 67.15,34.8 68.48,34.8 69.8,36.13 70.01,36.13 70.62,36.74 70.62,37.45 69.8,38.27 67.15,38.27 U$2.RD- 67.05,38.27 64.39,35.62 v52.96,35.62
RESET  (via drill 0.35)
  Top 0.203: R2.1 58.68,82.15 C2.1 58.78,82.15 64.39,87.76 68.07,87.76 69.09,88.78 BL.5 | v64.39,72.66 64.39,71.54 63.17,70.31 63.17,70.11 MC.29 63.07,70.01 62.56,69.5 59.39,69.5 45.31,55.41 v45.31,48.37
  Bottom 0.203: v64.39,72.66 64.39,84.19 69.09,88.89 BL.5 | v45.31,48.37 45.31,33.47 51.74,27.04 74.5,27.04 80.42,21.12 82.05,21.12 SR.1
RXI  (via drill 0.35)
  Top 0.203: v65.62,71.44 63.78,69.6 MC.30 | v67.25,67.05 67.25,65.21 66.33,64.29 66.33,64.09 65.21,62.97 65.01,62.97 64.29,62.25 64.29,58.88 71.94,51.23 74.09,51.23 74.8,50.52 74.8,49.49 72.97,47.66 PP.4
  Bottom 0.203: v65.62,71.44 65.62,71.03 67.25,69.39 v67.25,67.05
TD+  (via drill 0.35)
  Top 0.203: v59.6,33.98 60.41,33.98 ERN1.1 | v57.96,34.29 56.64,35.62 55.82,35.62 ENC.17
  Bottom 0.203: v59.6,33.98 59.6,33.57 59.14,33.12 | 59.14,33.12 57.96,31.94 57.96,31.02 58.37,30.61 68.27,30.61 69.6,31.94 U$2.TD+ | 59.14,33.12 v57.96,34.29
TD-
  Top 0.203: 58.53,32.5 57.76,31.74 57.76,31.64 57.56,31.43 56.54,31.43 56.23,31.74 56.23,33.47 56.84,34.09 56.84,34.8 56.64,35 55.82,35 ENC.16 | 58.53,32.5 59.29,33.27 60.41,33.27 ERN1.2 | 58.53,32.5 60.01,31.02 63.48,31.02 65.62,33.17 67.05,33.17 U$2.TD-
TXO
  Top 0.203: MC.31 64.19,68.88 64.19,68.58 61.13,65.52 61.13,55.62 64.7,52.05 70.52,52.05 72.35,50.21 72.86,50.21 PP.3
VDDO  (via drill 0.35)
  Top 0.254: OR5.5 50.01,69.7 50.01,70.42 OR5.6 50.01,70.52 50.01,71.13 OR5.7 50.01,71.33 50.01,71.94 OR5.8 50.11,71.94 v50.92,71.94 | OR3.8 50.01,83.99 50.01,83.27 OR3.7 50.01,83.17 50.01,82.56 OR3.6 50.01,82.35 50.01,81.74 OR3.5 50.01,81.54 v50.01,80.72 | D2.3 18.47,56.84 22.35,56.84 D1.3 22.45,56.94 22.86,56.94 24.08,58.17 24.08,60.92 22.45,62.56 D3.3 | v19.39,62.66 18.47,62.66 D4.3 | v21.33,62.66 22.35,62.66 D3.3 | 18.06,79.5 18.06,80.31 24.8,87.05 24.8,90.52 OMF.1 29.59,90.62 OD2.C 29.8,90.62 31.33,89.09 40.11,89.09 41.84,90.83 42.35,90.83 EC6.+ | 18.06,79.5 18.06,79.29 U1.10 | D3.3 22.66,62.45 24.08,63.88 24.08,72.97 20.31,76.74 20.31,77.35 18.16,79.5 18.06,79.5
  Bottom 0.254: v50.01,80.72 50.92,79.8 v50.92,71.94 32.96,71.94 23.68,62.66 v21.33,62.66 v19.39,62.66
VIN
  Top 0.203: PJ1.VIN0 82.56,4.39 81.03,2.86 75.01,2.86 73.58,4.29 70.82,4.29 PD1.A 70.72,4.29 67.97,1.53 37.35,1.53 30.72,8.16 8.7,8.16 5.71,11.15 5.71,47.45 XV.2
WFGPIO0
  Bottom 0.203: WIFI.GPIO0 67.86,64.5 67.86,65.41 65.82,67.45 65.82,70.21 61.74,74.29 54.29,74.29 47.76,67.76 44.49,67.76 30.82,54.09 30.82,52.66 18.06,39.9 18.06,30.41 GPIO.6
WFGPIO2
  Bottom 0.203: WIFI.GPIO2 65.31,64.39 64.5,64.39 63.07,62.97 53.17,62.97 20.61,30.41 GPIO.5

### Text on the board
tPlace: ON | Edge MOUT | IOTECH © 2019 | IOTB v2.9 TOP | S/N: | www.iotech.com.tr
bPlace: IOTB BOT | IOTECH | MOUT
bNames: C:/Users/celikada/Downloads/5.bmp